# EasyEDA Pro project 2024-SS-ZT-1.eprj

# Schematic SCH

## Sheets
1 P1: Create Date: 2024-05-16; Page Name: P1; Project Name: 2024-SS-ZT-1; Schematic Name: SCH; Update Date: 2024-05-16; Company: EDA设计与开发; Page Size: A4; Version: V1.0
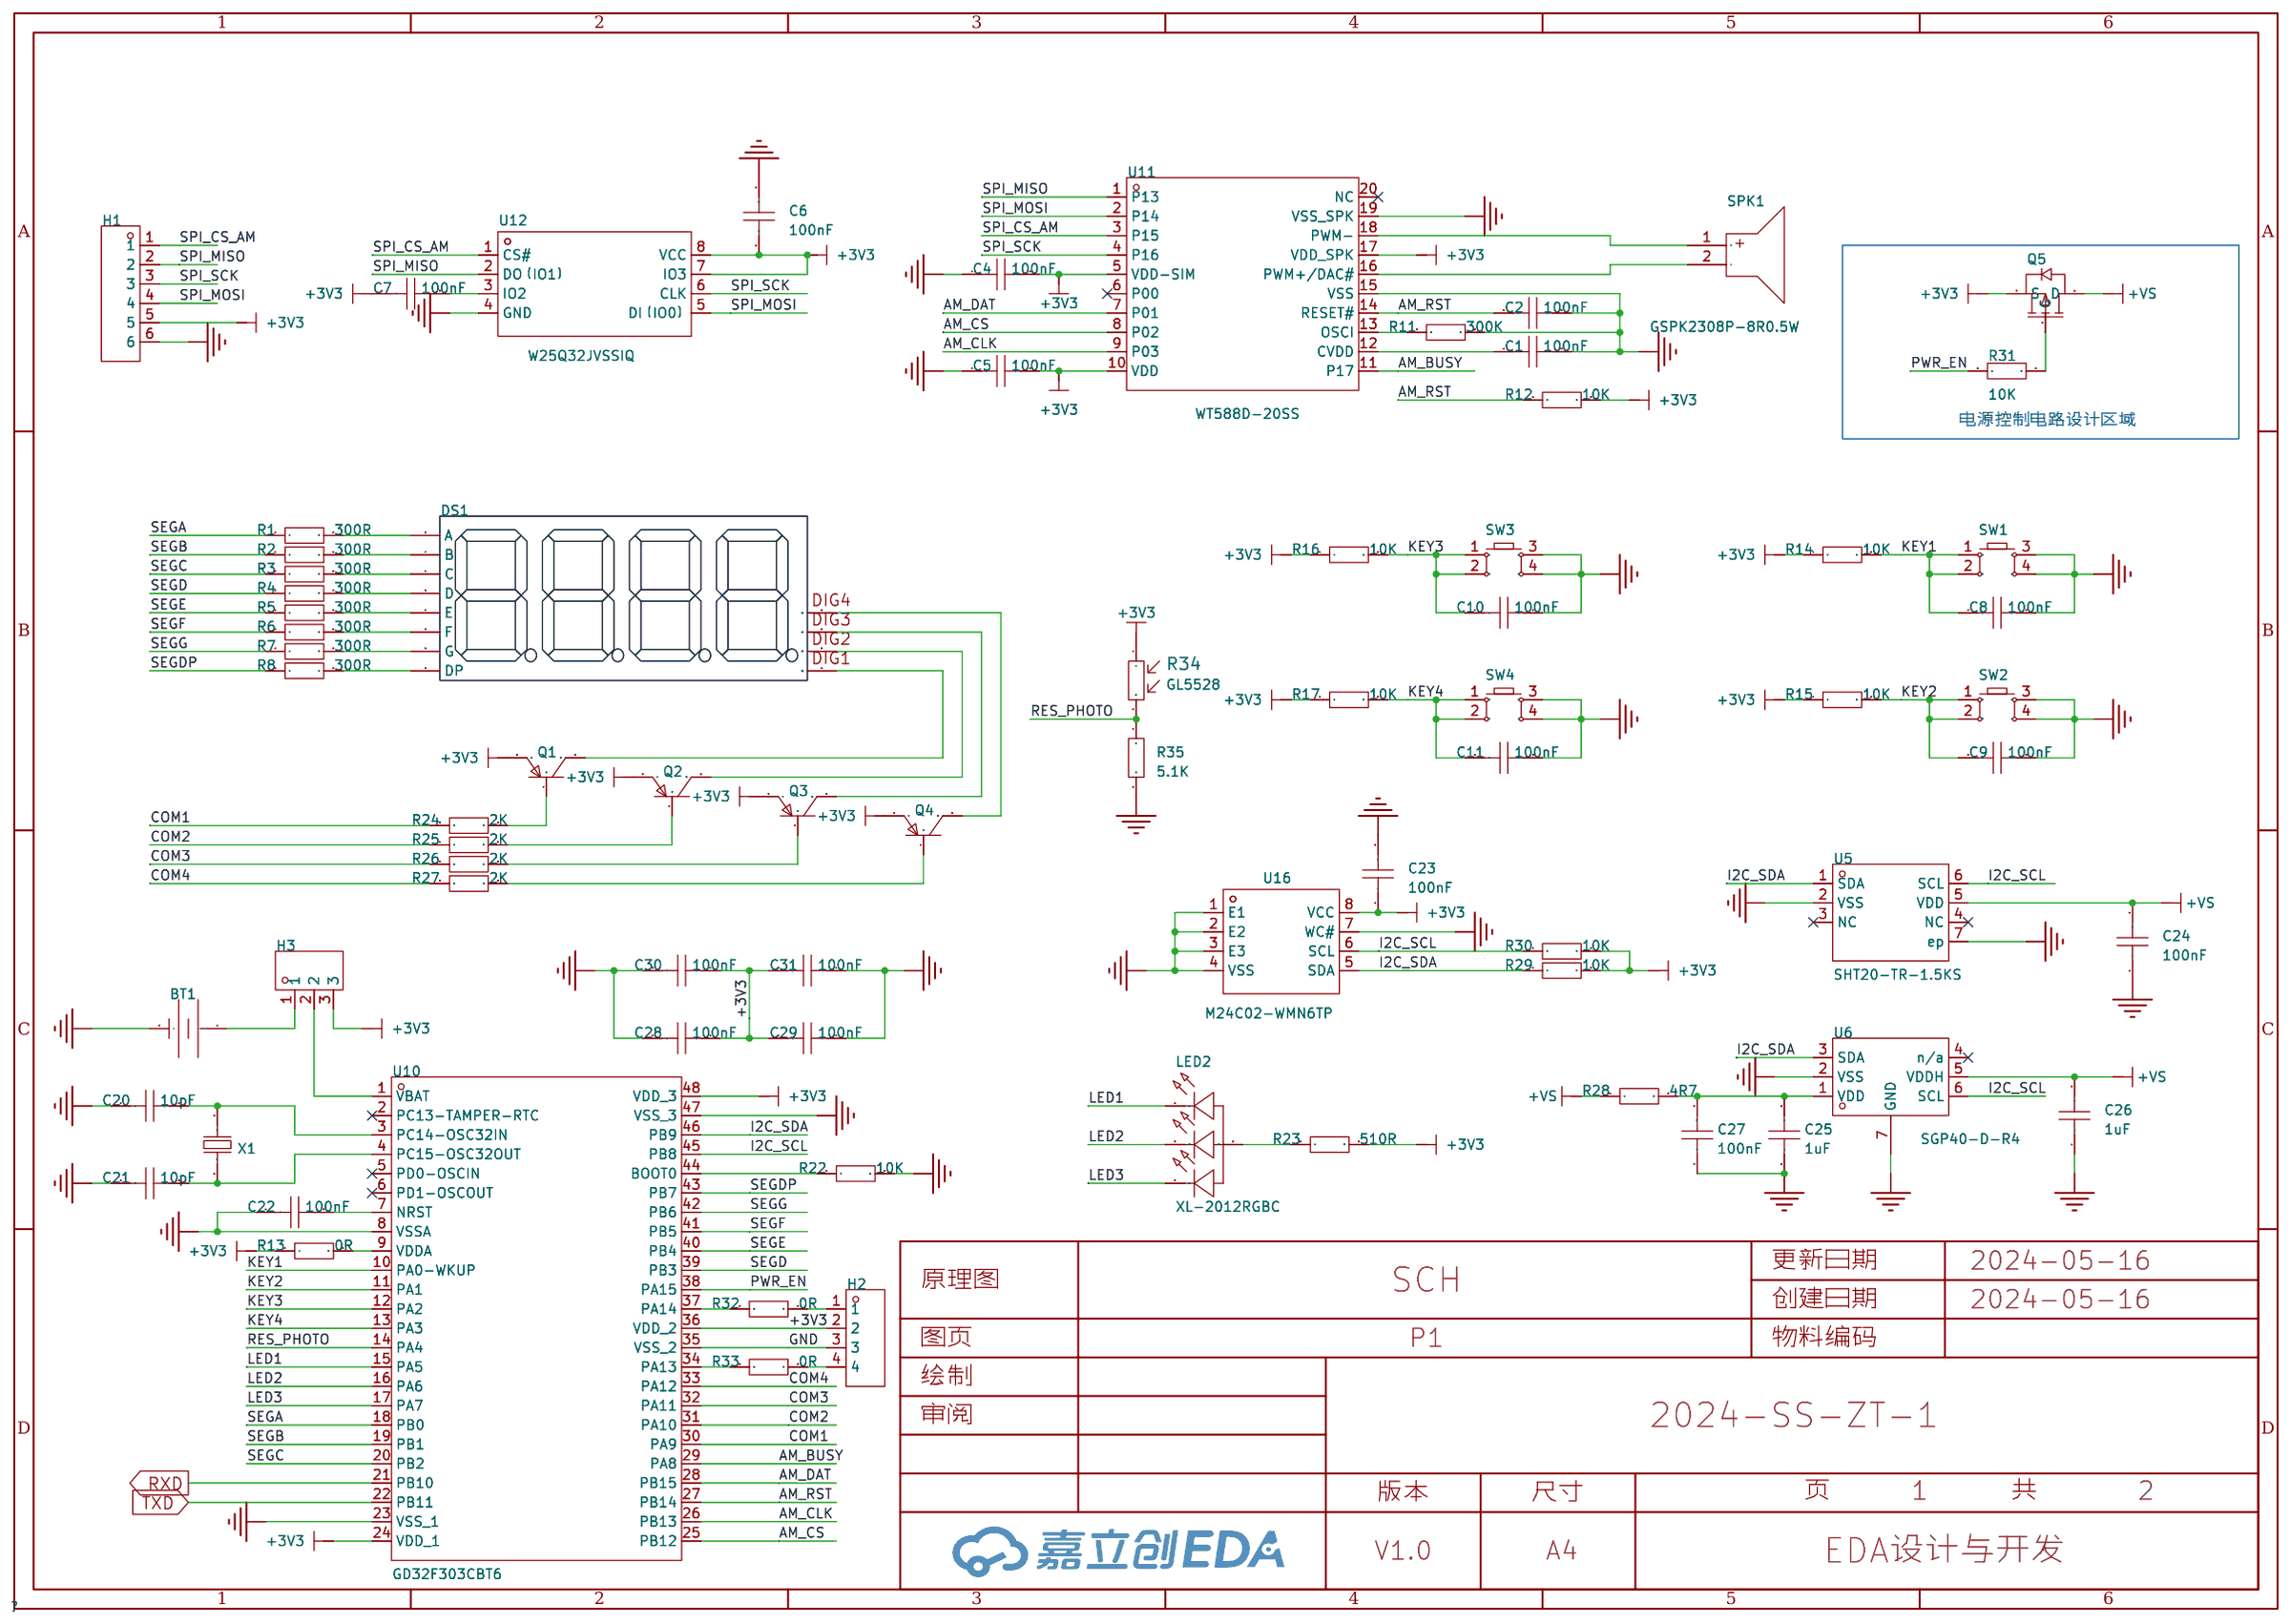
[diagram p0: P1]
2 P2: Page Name: P2; Company: 嘉立创EDA
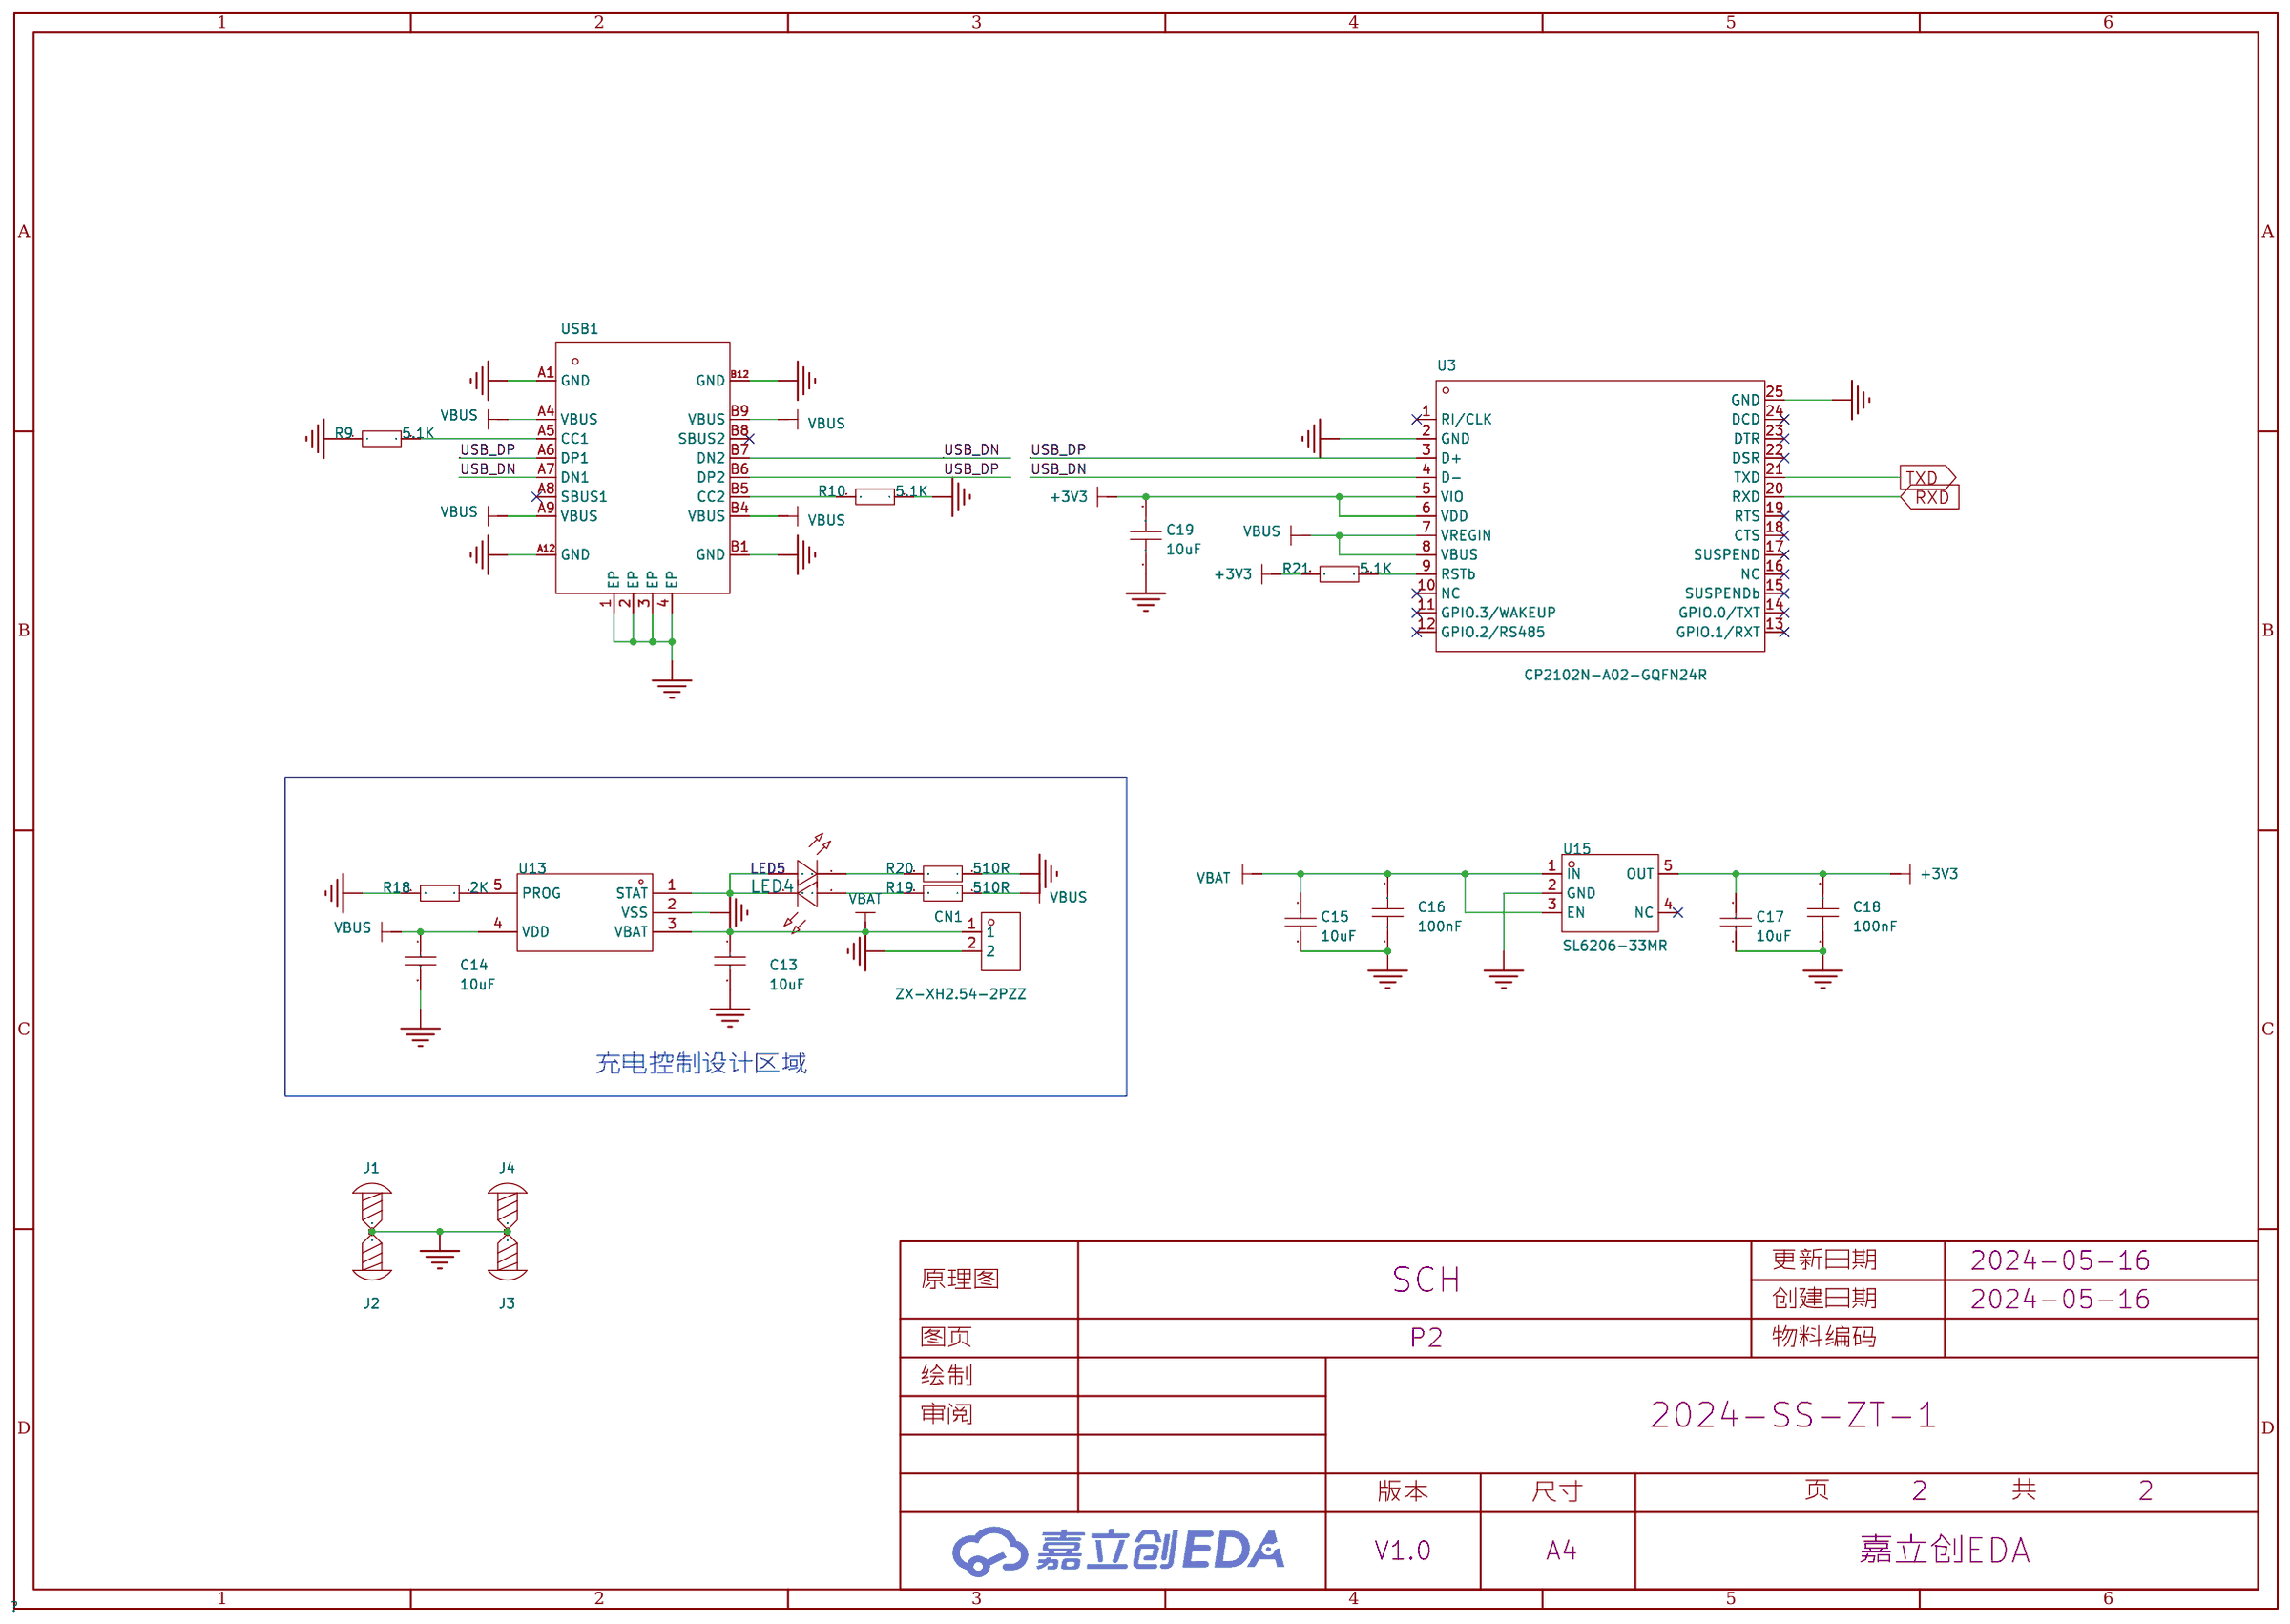
[diagram p1: P2]

## Parts
sheet P1
BT1  BS-12-B3AA003  [BAT-SMD_BS-12-B3AA011]
C1  100nF  [C0805]
C2  100nF  [C0805]
C4  100nF  [C0805]
C5  100nF  [C0805]
C6  100nF  [C0805]
C7  100nF  [C0805]
C8  100nF  [C0805]
C9  100nF  [C0805]
C10  100nF  [C0805]
C11  100nF  [C0805]
C20  10pF  [C0805]
C21  10pF  [C0805]
C22  100nF  [C0805]
C23  100nF  [C0805]
C24  100nF  [C0805]
C25  1uF  [C0805]
C26  1uF  [C0805]
C27  100nF  [C0805]
C28  100nF  [C0805]
C29  100nF  [C0805]
C30  100nF  [C0805]
C31  100nF  [C0805]
DS1  -  [LED-SEG-TH_FJ5461AH]
H1  -  [HDR-TH_6P-P2.54-V-F]
H2  -  [HDR-TH_4P-P2.54-V-F]
H3  Jumper3  [HDR-TH_3P-P2.54-V-M-A]
LED2  XL-2012RGBC  [LED-SMD_4P-L2.0-W1.3-BR]
Q1  -  [S8550P_SOT]
Q2  -  [S8550P_SOT]
Q3  -  [S8550P_SOT]
Q4  -  [S8550P_SOT]
Q5  -  [AO3401A_SOT-23-3]
R1  300R  [R0805]
R2  300R  [R0805]
R3  300R  [R0805]
R4  300R  [R0805]
R5  300R  [R0805]
R6  300R  [R0805]
R7  300R  [R0805]
R8  300R  [R0805]
R11  300K  [R0805]
R12  10K  [R0805]
R13  0R  [R0805]
R14  10K  [R0805]
R15  10K  [R0805]
R16  10K  [R0805]
R17  10K  [R0805]
R22  10K  [R0805]
R23  510R  [R0805]
R24  2K  [R0805]
R25  2K  [R0805]
R26  2K  [R0805]
R27  2K  [R0805]
R28  4R7  [R0805]
R29  10K  [R0805]
R30  10K  [R0805]
R31  10K  [R0805]
R32  0R  [R0805]
R33  0R  [R0805]
R34  GL5528  [RES-TH_L5.1-W4.3-P3.40-D0.5]
R35  5.1K  [R0805]
SPK1  GSPK2308P-8R0.5W  [SPK-TH_BD23.0-P10.00-D0.8-L-RD]
SW1  -  [Key_SMD_12x12x7.3]
SW2  -  [Key_SMD_12x12x7.3]
SW3  -  [Key_SMD_12x12x7.3]
SW4  -  [Key_SMD_12x12x7.3]
U5  SHT20-TR-1.5KS  [DFN-6_L3.0-W3.0-P0.95-TR-EP]
U6  SGP40-D-R4  [DFN-6_L2.4-W2.4-P0.80-TL-EP]
U10  GD32F303CBT6  [LQFP-48_L7.0-W7.0-P0.50-LS9.0-BL]
U11  WT588D-20SS  [SSOP-20_L7.2-W5.3-P0.65-LS7.8-BL]
U12  W25Q32JVSSIQ  [SOIC-8_L5.3-W5.3-P1.27-LS8.0-BL]
U16  M24C02-WMN6TP  [SOIC-8_L4.9-W3.9-P1.27-LS6.0-BL]
X1  32.768kHz  [FC-135R_L3.2-W1.5]
sheet P2
C13  10uF  [C1206]
C14  10uF  [C1206]
C15  10uF  [C1206]
C16  100nF  [C0805]
C17  10uF  [C1206]
C18  100nF  [C0805]
C19  10uF  [C0805]
CN1  ZX-XH2.54-2PZZ  [CONN-TH_2P-P2.50_HX25003-2A]
J1  -  [M2螺丝]
J2  -  [M2螺丝]
J3  -  [M2螺丝]
J4  -  [M2螺丝]
LED4  -  [LED_0805]
LED5  -  [LED_0805]
R9  5.1K  [R0805]
R10  5.1K  [R0805]
R18  2K  [R0805]
R19  510R  [R0805]
R20  510R  [R0805]
R21  5.1K  [R0805]
U3  CP2102N-A02-GQFN24R  [QFN-24_L4.0-W4.0-P0.50-TL-EP2.6]
U13  -  [SOP_BCON]
U15  SL6206-33MR  [SOT-23-5_L2.9-W1.6-P0.95-LS2.8-BL]
USB1  -  [USB_TYPE-C-16P]

## Library data of the parts
BT1 = BS-12-B3AA003: 连接器类型:电池底座;适用电池规格:CR1220;工作温度范围:-25℃~+85℃;; Supplier Part: C964723; Manufacturer: MYOUNG(美阳); Supplier Footprint: SMD; JLCPCB Part Class: 扩展库; Datasheet: https://atta.szlcsc.com/upload/public/pdf/source/20201218/C964723_733B638E287393F86295A2A4DAE43C75.pdf; Supplier: LCSC; Connector Type: 电池底座; Battery Type: CR1220; Operating Temperature Range: -25℃~+85℃
C1 C2 C4-C11 C16 C18-C31 = CAP_0805: Supplier Footprint: 0805
DS1 = LED_SEG_TH_0.56x4: Supplier Footprint: 插件
H1 = HDR-F_2.54_1x6P: Supplier Part: C40877; Supplier Footprint: 插件
H2 = HDR-F_2.54_1x4P: Supplier Part: C2718488; Supplier Footprint: 插件
H3 = Jumper3: Supplier Part: C2940050; Supplier Footprint: HDR-TH-3P-2.54mm; JLCPCB Part Class: 扩展库; Supplier: LCSC
LED2 = XL-2012RGBC: 发光颜色:RGB三色;功率:80mW；80mW；55mW;正向电流:25mA;主波长:619nm~624nm；463nm~466nm；524nm~527nm;二极管配置:-;透镜颜色:无色透明透镜;色温:-;发光角度:120°;载带方式:正贴;工作温度:-30℃~+85℃;; Supplier Part: C965848; Manufacturer: XINGLIGHT(成兴光); Supplier Footprint: 0805; JLCPCB Part Class: 扩展库; Datasheet: https://atta.szlcsc.com/upload/public/pdf/source/20221102/35E310354F68AE1BCFC07B93F5E395D6.pdf; Supplier: LCSC; Emitted Color: RGB三色; Power Dissipation: 80mW；80mW；55mW; Forward Current: 25mA; Dominant Wavelength: 619nm~624nm；463nm~466nm；524nm~527nm; Peak Wavelength: 624nm；528nm；469nm; Lens Color: 无色透明透镜; Viewing Angle: 120°; Mounting Sytle: 正贴; Operating Temperature: -30℃~+85℃
Q1-Q4 = S8550_SOT_PNP: Supplier Footprint: SOT-23
Q5 = AO3401A_P: Supplier Footprint: SOT-23-3L; Supplier Part: C15127
R1-R33 R35 = Res_0805: Supplier Footprint: 0805
R34 = GL5528: 暗电阻:1MΩ;亮电阻 @ 10Lux:8kΩ~20kΩ;光谱峰值(波长):540nm;; LCSC Part Name: 亮电阻:8kΩ~20kΩ 暗电阻:1MΩ; Supplier Part: C125627; Manufacturer: 森霸; Supplier Footprint: 插件,P=3mm; JLCPCB Part Class: 扩展库; Datasheet: https://atta.szlcsc.com/upload/public/pdf/source/20230427/842A99E3D53A83729D7968886D4EFCBB.pdf; Supplier: LCSC; Dark Resistance: 1MΩ; Illuminated Resistance @ 10Lux: 8kΩ~20kΩ; Applied Voltage: 150V; Spectral Peak: 540nm
SPK1 = GSPK2308P-8R0.5W: Supplier Part: C530532; Manufacturer: INGHAi(赢海); JLCPCB Part Class: 扩展库; Datasheet: https://atta.szlcsc.com/upload/public/pdf/source/20200723/C530532_3DB1F973601B36F20FBCCA52751811A3.pdf; Supplier: LCSC
SW1-SW4 = Key_SMD_12x12x7.3: Supplier Footprint: SMD
U5 = SHT20-TR-1.5KS: 接口类型:I2C;; LCSC Part Name: 1-100706-01; Supplier Part: C53865; Manufacturer: Sensirion(瑞士盛思锐); Supplier Footprint: DFN-6-EP(3x3); JLCPCB Part Class: 扩展库; Datasheet: https://atta.szlcsc.com/upload/public/pdf/source/20151012/1457707445424.pdf; Supplier: LCSC; Interface Type: I2C; Supply Voltage: 2.1V~3.6V
U6 = SGP40-D-R4: 气体类型:空气质量;精度:-;; LCSC Part Name: 3.000.384; Supplier Part: C2874215; Manufacturer: Sensirion(瑞士盛思锐); Supplier Footprint: DFN-6-EP(2.4x2.4); JLCPCB Part Class: 扩展库; Datasheet: https://atta.szlcsc.com/upload/public/pdf/source/20231011/67A6038984BE66B07B1FF2325C50691F.pdf; Supplier: LCSC; Type: 空气质量; Operating Temperature: -10℃~+50℃
U10 = GD32F303CBT6_C3013779: CPU内核:CM4;程序存储容量:128KB;RAM总容量:32KB;GPIO端口数量:37;工作电压范围:-;CPU最大主频:120MHz;程序存储器类型:FLASH;; Supplier Part: C3013779; Manufacturer: GigaDevice(兆易创新); Supplier Footprint: LQFP-48(7x7); JLCPCB Part Class: 扩展库; Datasheet: https://atta.szlcsc.com/upload/public/pdf/source/20220624/E1A57ED816B162D6D1424864911A792F.pdf; Supplier: LCSC; CPU Core: CM4; Program Storage Size: 128KB; RAM Size: 32KB; GPIO Ports Number: 37; CPU Maximum Speed: 120MHz; Program Memory Type: FLASH; ADC (Bit): 12bit; DAC (Bit): 12bit; 16Bit Timer: 7; CAN: 1; UART/USART: 3; I2C: 2; I2S: 2; SPI: 3; Peripheral/Function: 看门狗；RTC实时时钟; Watchdog: 有; Real-Time Clock: 有
U11 = WT588D-20SS: 高品质语音芯片; Supplier Part: C87498; Manufacturer: WT(唯创知音); Supplier Footprint: SSOP-20-208mil; JLCPCB Part Class: 扩展库; Datasheet: https://atta.szlcsc.com/upload/public/pdf/source/20161217/1481939141189.pdf; Supplier: LCSC
U12 = W25Q32JVSSIQ_C82344: 接口类型:SPI;存储容量:32Mbit;; Supplier Part: C82344; Manufacturer: WINBOND(华邦); Supplier Footprint: SOIC-8-208mil; JLCPCB Part Class: 扩展库; Datasheet: https://atta.szlcsc.com/upload/public/pdf/source/20160910/1473490310454.pdf; Supplier: LCSC; Interface Type: SPI; Memory Size: 32Mbit; Supply Voltage: 2.7V~3.6V; Page Programming Time (Tpp): 3ms; Operating Temperature: -40℃~+85℃
U16 = M24C02-WMN6TP: 接口类型:I2C;存储容量:2Kbit;; Supplier Part: C7562; Manufacturer: ST(意法半导体); Supplier Footprint: SOIC-8; JLCPCB Part Class: Extended Part; Datasheet: https://atta.szlcsc.com/upload/public/pdf/source/20140724/1457707167301.pdf; Supplier: LCSC; Interface Type: I2C; Memory Size: 2Kbit; Supply Voltage: 2.5V~5.5V; Operating Temperature: -40℃~+85℃
X1 = Q13FC13500004_C32346: 晶振类型:贴片晶振;频率:32.768kHz;常温频差:±20ppm;外接负载电容:12.5pF;; LCSC Part Name: 32.768kHz ±20ppm 12.5pF; Supplier Part: C32346; Manufacturer: EPSON(爱普生); Manufacturer Part: Q13FC13500004; Supplier Footprint: SMD3215-2P; JLCPCB Part Class: 基础库; Datasheet: https://atta.szlcsc.com/upload/public/pdf/source/20190108/C32346_746D6B07EAF90824457A96480007685F.pdf; Supplier: LCSC; Crystal Type: 贴片晶振; Normal temperature Frequency Tolerance: ±20ppm; External load capacitor: 12.5pF; Equivalent Series Resistance (ESR): 70kΩ; Operating Temperature: -40℃~+85℃
C13-C15 C17 = CL31A106KBHNNNE: 容值:10uF;精度:±10%;额定电压:50V;材质(温度系数):X5R;; LCSC Part Name: 10uF ±10% 50V; Supplier Part: C13585; Manufacturer: SAMSUNG(三星); Supplier Footprint: 1206; JLCPCB Part Class: 基础库; Datasheet: https://atta.szlcsc.com/upload/public/pdf/source/20160218/1457707763339.pdf; Supplier: LCSC; Tolerance: ±10%; Voltage Rated: 50V; Temperature Coefficient: X5R
CN1 = ZX-XH2.54-2PZZ: 插针结构:1x2P;间距:2.54mm;安装方式:直插;参考系列:XH;总PIN数:2P;排数:1;每排PIN数:2;行距:-;额定电流:3A;触头材质:黄铜;触头镀层:锡;工作温度范围:-25℃~+85℃;; Supplier Part: C7429632; Manufacturer: Megastar(兆星); Supplier Footprint: 插件,P=2.54mm; JLCPCB Part Class: 扩展库; Datasheet: https://atta.szlcsc.com/upload/public/pdf/source/20230619/19BA6947230AA44A04D3EDD65E618FD0.pdf; Supplier: LCSC; Pins Structure: 1x2P; Pitch: 2.54mm; Mounting Style: 直插; Reference Series: XH; Number of Pins: 2P; Number of Rows: 1; Number of PINs Per Row: 2; Current Rating (Max): 3A; Contact Material: 黄铜; Contact Plating: 锡; Operating Temperature Range: -25℃~+85℃
J1-J4 = M2螺丝: Supplier Footprint: 插件
LED4 = LED_0805-R: Supplier Footprint: 0805
LED5 = LED_0805-G: Supplier Footprint: 0805
U3 = CP2102N-A02-GQFN24R: 应用功能:USB转UART;接口协议:UART;; Supplier Part: C969151; Manufacturer: SKYWORKS/SILICON LABS(芯科); Supplier Footprint: QFN-24-EP(4x4); JLCPCB Part Class: 扩展库; Datasheet: https://atta.szlcsc.com/upload/public/pdf/source/20201204/C964632_F2B790CC23A72455AEF523510305B30A.pdf; Supplier: LCSC; Applications Function: USB转UART; Protocol: UART; Supply Voltage: 3V~3.6V; Operating Temperature: -40℃~+85℃@(Ta)
U13 = BCON
U15 = SL6206-33MR: 输出类型:-;; Supplier Part: C707122; Manufacturer: Slkor(萨科微); Supplier Footprint: SOT-23-5; JLCPCB Part Class: 扩展库; Datasheet: https://atta.szlcsc.com/upload/public/pdf/source/20200721/C707121_33633D17E61D5DC97F22208BE63A0FB1.pdf; Supplier: LCSC
USB1 = USB_TYPE-C-16P: Supplier Footprint: SMD

## Nets
+3V3: C4.2 C5.2 C6.2 C7.1 C17.2 C18.2 C19.2 C23.1 C28.1 C29.2 C30.1 C31.2 H1.5 H2.2 H3.3 Q1.2(E) Q2.2(E) Q3.2(E) Q4.2(E) Q5.2(S) R12.2 R13.1 R14.1 R15.1 R16.1 R17.1 R21.2 R23.2 R29.2 R30.2 R34.1 U3.5(VIO) U3.6(VDD) U10.24(VDD_1) U10.36(VDD_2) U10.48(VDD_3) U11.5(VDD-SIM) U11.10(VDD) U11.17(VDD_SPK) U12.7(IO3) U12.8(VCC) U15.5(OUT) U16.8(VCC)
GND: BT1.2(-) C1.2 C2.2 C4.1 C5.1 C6.1 C8.2 C9.2 C10.2 C11.2 C13.2 C14.2 C15.1 C16.1 C17.1 C18.1 C19.1 C20.1 C21.1 C22.1 C23.2 C24.1 C25.1 C26.1 C27.1 C28.2 C29.1 C30.2 C31.1 CN1.2 H1.6 H2.3 J1.1 J2.1 J3.1 J4.1 R9.1 R10.1 R11.2 R18.2 R20.1 R22.2 R35.2 SW1.3 SW1.4 SW2.3 SW2.4 SW3.3 SW3.4 SW4.3 SW4.4 U3.2(GND) U3.25(GND) U5.2(VSS) U5.7(ep) U6.2(VSS) U6.7(GND) U10.8(VSSA) U10.23(VSS_1) U10.35(VSS_2) U10.47(VSS_3) U11.15(VSS) U11.19(VSS_SPK) U12.4(GND) U13.2(VSS) U15.2(GND) U16.1(E1) U16.2(E2) U16.3(E3) U16.4(VSS) U16.7(WC#) USB1.1(EP) USB1.2(EP) USB1.3(EP) USB1.4(EP) USB1.A1(GND) USB1.A12(GND) USB1.B1(GND) USB1.B12(GND)
VBAT: C13.1 C15.2 C16.2 CN1.1 U13.3(VBAT) U15.1(IN) U15.3(EN)
VBUS: C14.1 R19.1 U3.7(VREGIN) U3.8(VBUS) U13.4(VDD) USB1.A4(VBUS) USB1.A9(VBUS) USB1.B4(VBUS) USB1.B9(VBUS)
+VS: C24.2 C26.2 Q5.3(D) R28.1 U5.5(VDD) U6.5(VDDH)
AM_BUSY: U10.29(PA8) U11.11(P17)
AM_CLK: U10.26(PB13) U11.9(P03)
AM_CS: U10.25(PB12) U11.8(P02)
AM_DAT: U10.28(PB15) U11.7(P01)
AM_RST: C2.1 R12.1 U10.27(PB14) U11.14(RESET#)
COM1: R24.1 U10.30(PA9)
COM2: R25.1 U10.31(PA10)
COM3: R26.1 U10.32(PA11)
COM4: R27.1 U10.33(PA12)
I2C_SCL: R30.1 U5.6(SCL) U6.6(SCL) U10.45(PB8) U16.6(SCL)
I2C_SDA: R29.1 U5.1(SDA) U6.3(SDA) U10.46(PB9) U16.5(SDA)
KEY1: C8.1 R14.2 SW1.1 SW1.2 U10.10(PA0-WKUP)
KEY2: C9.1 R15.2 SW2.1 SW2.2 U10.11(PA1)
KEY3: C10.1 R16.2 SW3.1 SW3.2 U10.12(PA2)
KEY4: C11.1 R17.2 SW4.1 SW4.2 U10.13(PA3)
LED1: LED2.1 U10.15(PA5)
LED2: LED2.2 U10.16(PA6)
LED3: LED2.4 U10.17(PA7)
PWR_EN: R31.2 U10.38(PA15)
RES_PHOTO: R34.2 R35.1 U10.14(PA4)
RXD: U3.20(RXD) U10.21(PB10)
SEGA: R1.1 U10.18(PB0)
SEGB: R2.1 U10.19(PB1)
SEGC: R3.1 U10.20(PB2)
SEGD: R4.1 U10.39(PB3)
SEGDP: R8.1 U10.43(PB7)
SEGE: R5.1 U10.40(PB4)
SEGF: R6.1 U10.41(PB5)
SEGG: R7.1 U10.42(PB6)
SPI_CS_AM: H1.1 U11.3(P15) U12.1(CS#)
SPI_MISO: H1.2 U11.1(P13) U12.2(DO（IO1）)
SPI_MOSI: H1.4 U11.2(P14) U12.5(DI（IO0）)
SPI_SCK: H1.3 U11.4(P16) U12.6(CLK)
TXD: U3.21(TXD) U10.22(PB11)
USB_DN: U3.4(D-) USB1.A7(DN1) USB1.B7(DN2)
USB_DP: U3.3(D+) USB1.A6(DP1) USB1.B6(DP2)
$1N1449: DS1.8(DIG3) Q3.3(C)
$1N1467: DS1.1(E) R5.2
$1N1471: DS1.2(D) R4.2
$1N1475: DS1.3(DP) R8.2
$1N1479: DS1.4(C) R3.2
$1N1483: DS1.5(G) R7.2
$1N1487: DS1.11(A) R1.2
$1N1491: DS1.7(B) R2.2
$1N1495: DS1.10(F) R6.2
$1N6161: C1.1 U11.12(CVDD)
$1N6192: R11.1 U11.13(OSCI)
$1N6375: SPK1.1(+) U11.18(PWM-)
$1N6384: SPK1.2(-) U11.16(PWM+/DAC#)
$1N6917: C7.2 U12.3(IO2)
$1N7212: R13.2 U10.9(VDDA)
$1N7925: C20.2 U10.3(PC14-OSC32IN) X1.1
$1N7930: C21.2 U10.4(PC15-OSC32OUT) X1.2
$1N8028: R22.1 U10.44(BOOT0)
$1N8104: LED2.3 R23.1
$1N8256: DS1.12(DIG1) Q1.3(C)
$1N8335: DS1.9(DIG2) Q2.3(C)
$1N8343: DS1.6(DIG4) Q4.3(C)
$1N8477: Q1.1(B) R24.2
$1N8481: Q2.1(B) R25.2
$1N8485: Q3.1(B) R26.2
$1N8489: Q4.1(B) R27.2
$1N8598: C22.2 U10.7(NRST)
$1N9384: C25.2 C27.2 R28.2 U6.1(VDD)
$1N9794: R32.1 U10.37(PA14)
$1N9795: H2.1 R32.2
$1N9824: R33.1 U10.34(PA13)
$1N9825: H2.4 R33.2
$1N10132: BT1.1(+) H3.1
$1N10135: H3.2 U10.1(VBAT)
$1N18652: Q5.1(G) R31.1
$2N394: R9.2 USB1.A5(CC1)
$2N397: R10.2 USB1.B5(CC2)
$2N1836: R21.1 U3.9(RSTb)
$2N6842: R18.1 U13.5(PROG)
$2N6856: LED4.1(C) LED5.2(A) U13.1(STAT)
$2N6873: LED4.2(A) R19.2
$2N6876: LED5.1(C) R20.2

Not connected (* = marked no-connect by the designer): U3 1(RI/CLK)* 10(NC)* 11(GPIO.3/WAKEUP)* 12(GPIO.2/RS485)* 13(GPIO.1/RXT)* 14(GPIO.0/TXT)* 15(SUSPENDb)* 16(NC)* 17(SUSPEND)* 18(CTS)* 19(RTS)* 22(DSR)* 23(DTR)* 24(DCD)*; U5 3(NC)* 4(NC)*; U6 4(n/a)*; U10 2(PC13-TAMPER-RTC)* 5(PD0-OSCIN)* 6(PD1-OSCOUT)*; U11 6(P00)* 20(NC)*; U15 4(NC)*; USB1 A8(SBUS1)* B8(SBUS2)*

## Notes on the sheets
sheet 1
- 电源控制电路设计区域
sheet 2
- 充电控制设计区域

# Board PCB
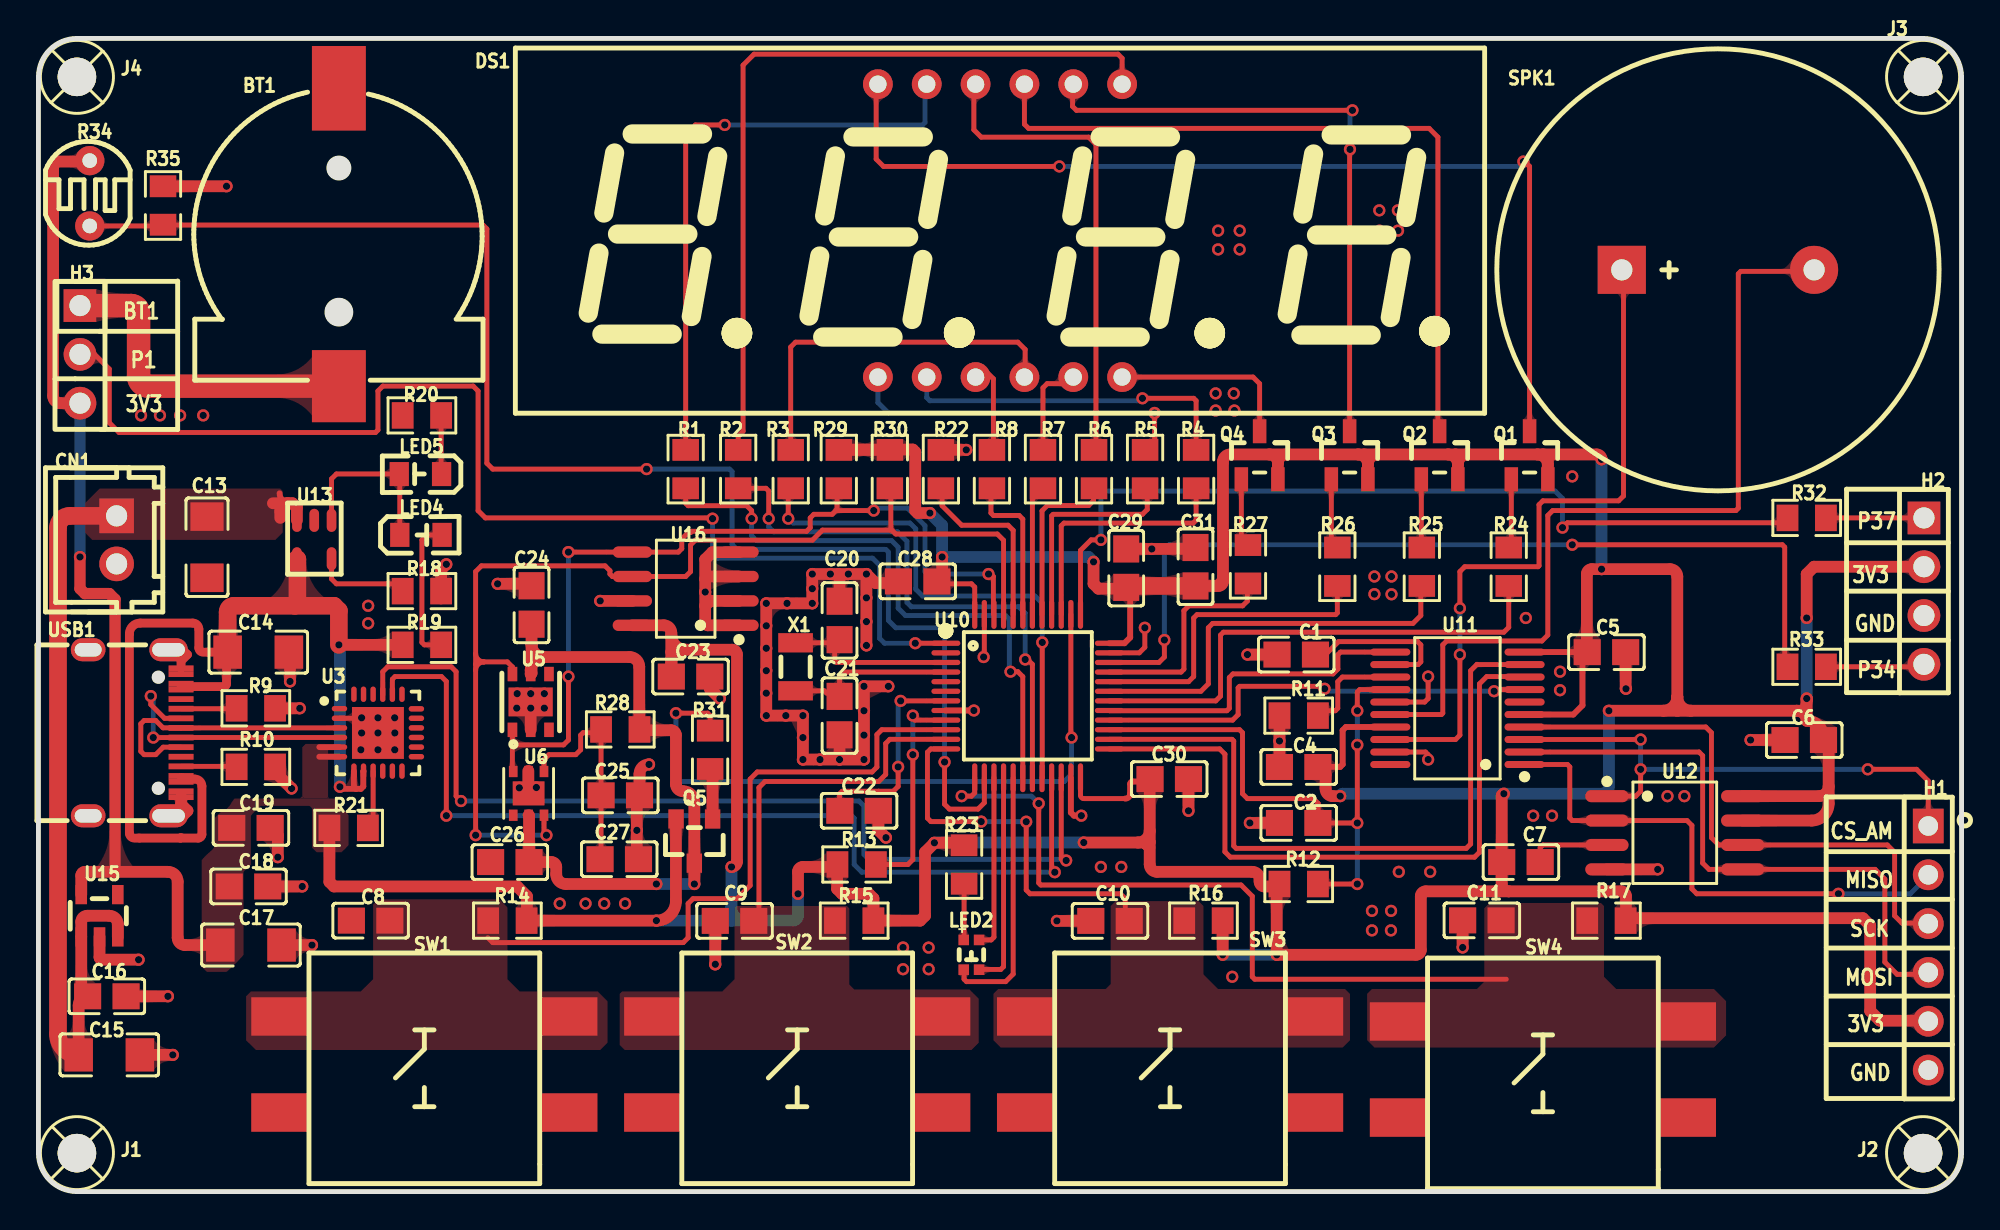
[diagram p2: board, top side]
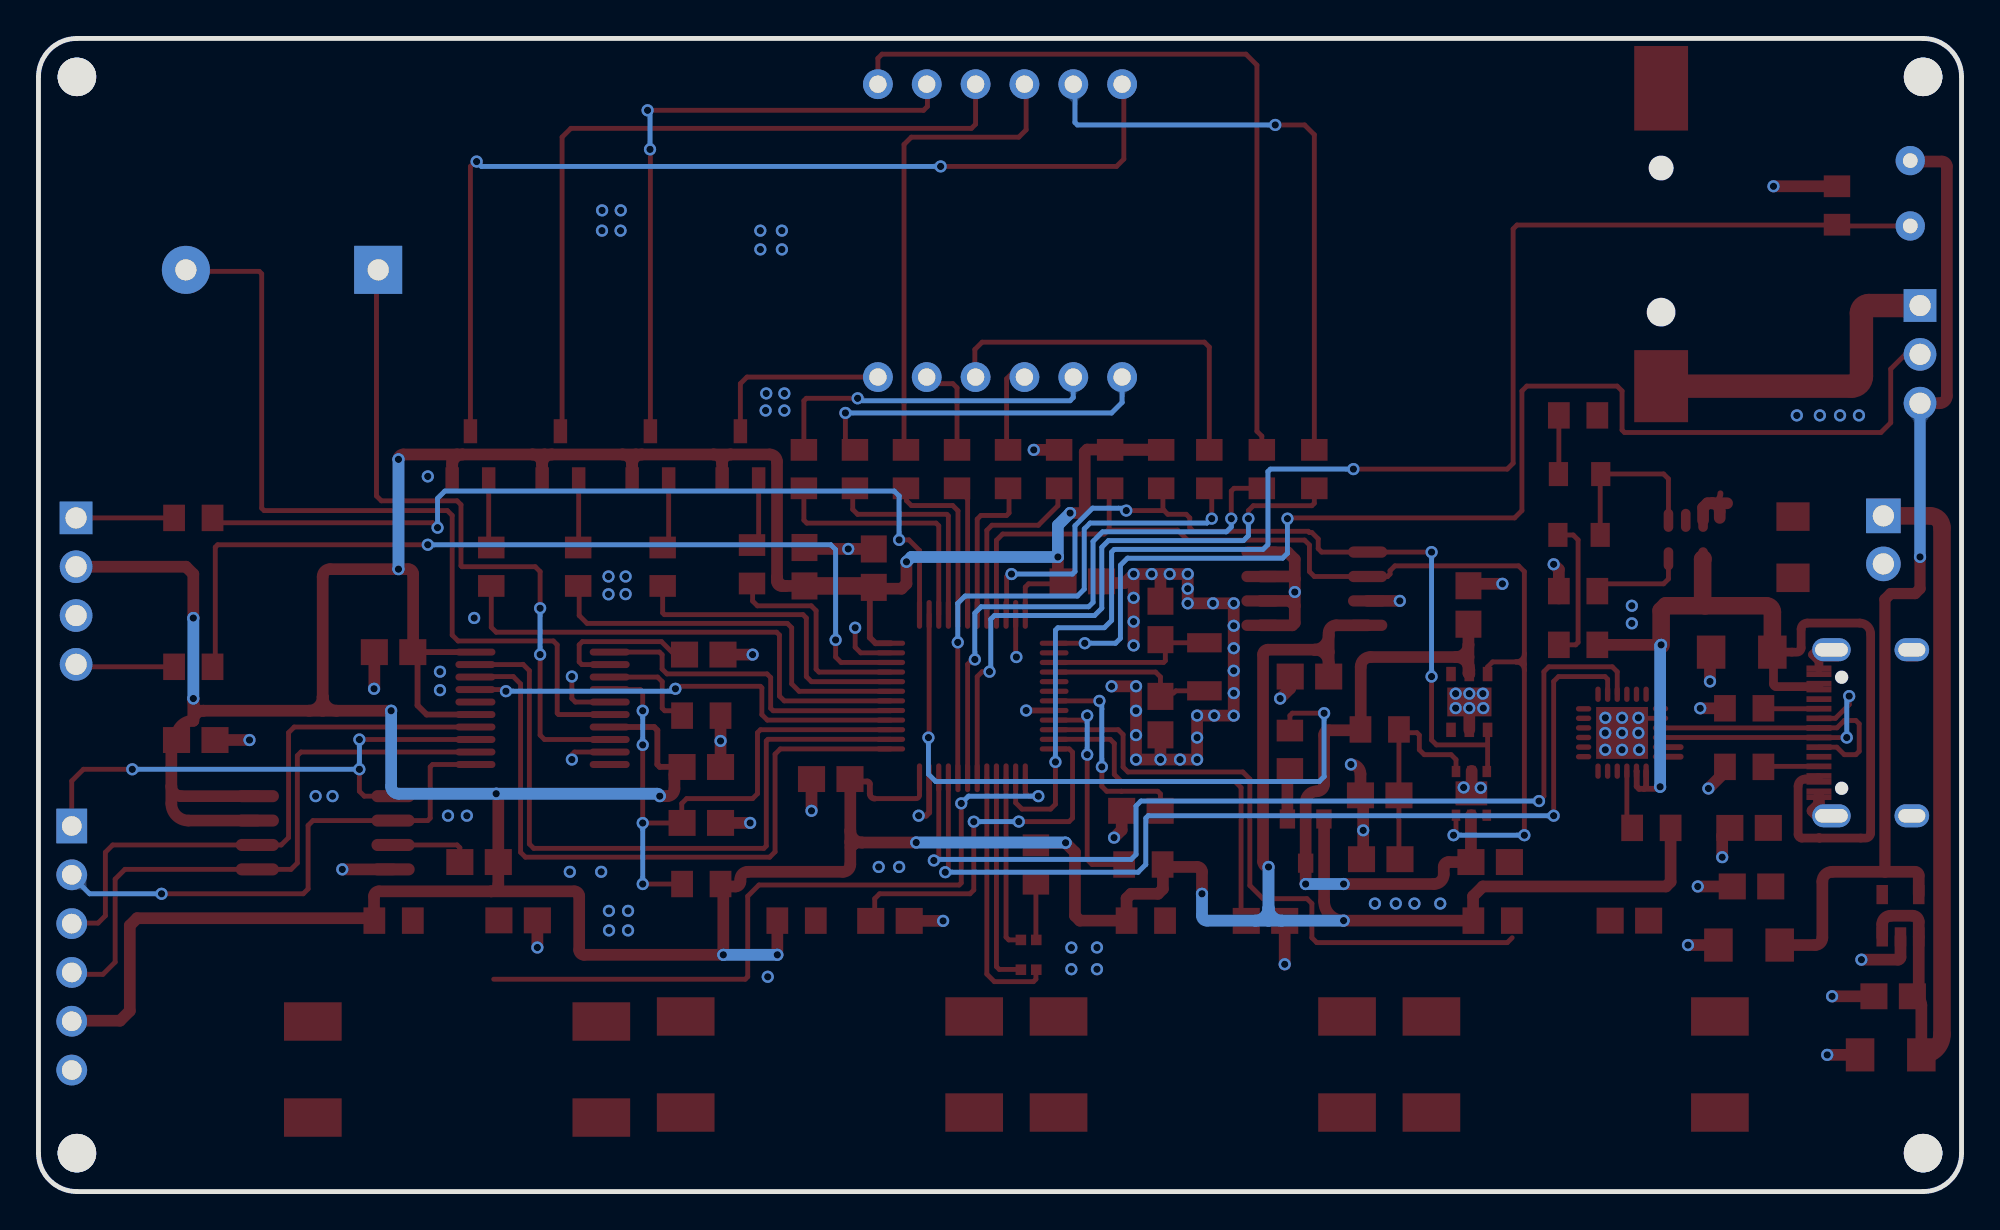
[diagram p3: board, bottom side, seen from below]

Outline 100 x 60 mm; copper layers: Top Layer, Inner1, Inner2, Inner3, Inner4, Inner5, Inner6, Inner7, Inner8, Inner9, Inner10, Inner11, Inner12, Inner13, Inner14, Inner15, Inner16, Inner17, Inner18, Inner19, Inner20, Inner21, Inner22, Inner23, Inner24, Inner25, Inner26, Inner27, Inner28, Inner29, Inner30, Bottom Layer. Coordinates in mm from the lower left corner of the outline.
Outline path: 0,58 0,2 arc(0.59,0.59) 2,0 98,0 arc(99.41,0.59) 100,2 100,58 arc(99.41,59.41) 98,60 2,60 arc(0.59,59.41) 0,58
Stack: Top Layer 0.035mm / Dielectric1 1.51mm FR4 er 4.5 / Bottom Layer 0.035mm

## Design rules (mm)
net USB_DP: DP1
net USB_DN: DP1
template: 自定义配置
spacing copperThickness1oz (default): track to track 0.203, other pairs 0.178 to 0.203
spacing copperThickness2oz: track to track 0.203, other pairs 0.152 to 0.3
track width copperThickness1oz (default): min 0.254, default 0.254, max 2.54
track width copperThickness2oz: min 0.203, default 0.254, max 2.54
track width PWR: min 0.254, default 0.61, max 2.54
differential pair differentialPair (default): width min 0.127, default 0.254, max 2.54; gap min 0.152, default 0.152
via viaSize (default): diameter min 0.635, default 0.635, max 10; hole min 0.381, default 0.381, max 6.299
net GND uses PWR
net +3V3 uses PWR
net +VS uses PWR
net VBUS uses PWR
net VBAT uses PWR

## Placement (name value [footprint] x y rotation side)
BT1  BS-12-B3AA003  [BAT-SMD_BS-12-B3AA011]  15.62 49.66 270 top
C1  100nF  [C0805]  65.41 27.94 180 top
C2  100nF  [C0805]  65.53 19.18 180 top
C4  100nF  [C0805]  65.53 22.09 0 top
C5  100nF  [C0805]  81.53 28.07 180 top
C6  100nF  [C0805]  91.82 23.5 0 top
C7  100nF  [C0805]  77.09 17.14 0 top
C8  100nF  [C0805]  17.27 14.1 180 top
C9  100nF  [C0805]  36.19 14.08 180 top
C10  100nF  [C0805]  55.72 14.08 180 top
C11  100nF  [C0805]  75.06 14.11 180 top
C13  10uF  [C1206]  8.76 33.53 270 top
C14  10uF  [C1206]  11.43 28.07 0 top
C15  10uF  [C1206]  3.68 7.11 180 top
C16  100nF  [C0805]  3.56 10.16 180 top
C17  10uF  [C1206]  11.05 12.83 180 top
C18  100nF  [C0805]  10.92 15.88 180 top
C19  10uF  [C0805]  11.05 18.92 180 top
C20  10pF  [C0805]  41.66 29.72 270 top
C21  10pF  [C0805]  41.66 24.77 90 top
C22  100nF  [C0805]  42.67 19.81 180 top
C23  100nF  [C0805]  33.91 26.8 0 top
C24  100nF  [C0805]  25.64 30.52 270 top
C25  1uF  [C0805]  30.25 20.62 180 top
C26  1uF  [C0805]  24.51 17.14 0 top
C27  100nF  [C0805]  30.2 17.29 180 top
C28  100nF  [C0805]  45.72 31.75 180 top
C29  100nF  [C0805]  56.56 32.44 270 top
C30  100nF  [C0805]  58.8 21.46 0 top
C31  100nF  [C0805]  60.17 32.51 270 top
CN1  ZX-XH2.54-2PZZ  [CONN-TH_2P-P2.50_HX25003-2A]  4.06 33.91 270 top
DS1  -  [LED-SEG-TH_FJ5461AH]  50 50 0 top
H1  -  [HDR-TH_6P-P2.54-V-F]  98.27 12.67 270 top
H2  -  [HDR-TH_4P-P2.54-V-F]  98.04 31.24 270 top
H3  Jumper3  [HDR-TH_3P-P2.54-V-M-A]  2.16 43.56 270 top
J1  -  [M2螺丝]  2 2 0 top
J2  -  [M2螺丝]  98 2 0 top
J3  -  [M2螺丝]  98 58 0 top
J4  -  [M2螺丝]  2 58 0 top
LED2  XL-2012RGBC  [LED-SMD_4P-L2.0-W1.3-BR]  48.51 12.32 90 top
LED4  -  [LED_0805]  19.94 34.16 0 top
LED5  -  [LED_0805]  19.81 37.34 180 top
Q1  -  [S8550P_SOT]  77.54 38.35 270 top
Q2  -  [S8550P_SOT]  72.86 38.35 270 top
Q3  -  [S8550P_SOT]  68.18 38.35 270 top
Q4  -  [S8550P_SOT]  63.5 38.35 270 top
Q5  -  [AO3401A_SOT-23-3]  34.11 18.24 90 top
R1  300R  [R0805]  33.66 37.59 90 top
R2  300R  [R0805]  36.39 37.59 90 top
R3  300R  [R0805]  39.12 37.59 90 top
R4  300R  [R0805]  60.2 37.59 90 top
R5  300R  [R0805]  57.54 37.59 90 top
R6  300R  [R0805]  54.89 37.59 90 top
R7  300R  [R0805]  52.24 37.59 90 top
R8  300R  [R0805]  49.58 37.59 90 top
R9  5.1K  [R0805]  11.3 25.15 180 top
R10  5.1K  [R0805]  11.3 22.1 180 top
R11  300K  [R0805]  65.53 24.77 180 top
R12  10K  [R0805]  65.53 16 180 top
R13  0R  [R0805]  42.54 17.02 0 top
R14  10K  [R0805]  24.38 14.1 180 top
R15  10K  [R0805]  42.42 14.1 180 top
R16  10K  [R0805]  60.58 14.1 180 top
R17  10K  [R0805]  81.53 14.1 180 top
R18  2K  [R0805]  19.94 31.24 0 top
R19  510R  [R0805]  19.94 28.45 0 top
R20  510R  [R0805]  19.94 40.39 0 top
R21  5.1K  [R0805]  16.13 18.92 180 top
R22  10K  [R0805]  46.93 37.59 90 top
R23  510R  [R0805]  48.13 17.02 90 top
R24  2K  [R0805]  76.45 32.51 90 top
R25  2K  [R0805]  71.93 32.51 90 top
R26  2K  [R0805]  67.54 32.51 90 top
R27  2K  [R0805]  62.9 32.64 90 top
R28  4R7  [R0805]  30.25 24.05 180 top
R29  10K  [R0805]  41.62 37.59 90 top
R30  10K  [R0805]  44.27 37.59 90 top
R31  10K  [R0805]  34.93 22.99 90 top
R32  0R  [R0805]  91.95 35.05 0 top
R33  0R  [R0805]  91.95 27.31 0 top
R34  GL5528  [RES-TH_L5.1-W4.3-P3.40-D0.5]  2.67 51.94 0 top
R35  5.1K  [R0805]  6.48 51.31 90 top
SPK1  GSPK2308P-8R0.5W  [SPK-TH_BD23.0-P10.00-D0.8-L-RD]  87.33 47.96 0 top
SW1  -  [Key_SMD_12x12x7.3]  20.07 6.61 180 top
SW2  -  [Key_SMD_12x12x7.3]  39.45 6.61 180 top
SW3  -  [Key_SMD_12x12x7.3]  58.84 6.61 180 top
SW4  -  [Key_SMD_12x12x7.3]  78.23 6.35 180 top
U3  CP2102N-A02-GQFN24R  [QFN-24_L4.0-W4.0-P0.50-TL-EP2.6]  17.65 23.88 0 top
U5  SHT20-TR-1.5KS  [DFN-6_L3.0-W3.0-P0.95-TR-EP]  25.6 25.48 180 top
U6  SGP40-D-R4  [DFN-6_L2.4-W2.4-P0.80-TL-EP]  25.49 20.72 270 top
U10  GD32F303CBT6  [LQFP-48_L7.0-W7.0-P0.50-LS9.0-BL]  51.44 25.78 270 top
U11  WT588D-20SS  [SSOP-20_L7.2-W5.3-P0.65-LS7.8-BL]  73.79 25.15 90 top
U12  W25Q32JVSSIQ  [SOIC-8_L5.3-W5.3-P1.27-LS8.0-BL]  85.09 18.67 270 top
U13  -  [SOP_BCON]  15.24 34.92 270 top
U15  SL6206-33MR  [SOT-23-5_L2.9-W1.6-P0.95-LS2.8-BL]  3.17 14.35 0 top
U16  M24C02-WMN6TP  [SOIC-8_L4.9-W3.9-P1.27-LS6.0-BL]  33.66 31.37 90 top
USB1  -  [USB_TYPE-C-16P]  5 24 270 top
X1  32.768kHz  [FC-135R_L3.2-W1.5]  39.37 27.31 270 top

## Footprints (pads in the part's own frame, mm; a bottom-side part is the same pattern mirrored in y, then rotated)
AO3401A_SOT-23-3
  rect 1x0.8 smd: 1(1.15,-0.95) 2(1.15,0.95) 3(-1.15,0)
BAT-SMD_BS-12-B3AA011
  rect 3.75x2.8 smd: 1(7.75,0)
  rect 4.4x2.8 smd: 2(-7.75,0)
C0805
  rect 1.41x1.35 smd: 1(-1,0) 2(1,0)
C1206
  rect 1.485x1.728 smd: 1(-1.593,0) 2(1.593,0)
CONN-TH_2P-P2.50_HX25003-2A
  rect 1.8x1.8 hole 1.1: 1(-1.25,0)
  round 1.8 hole 1.1: 2(1.25,0)
DFN-6_L2.4-W2.4-P0.80-TL-EP
  rect 0.585x0.448 smd: 1(-1.137,0.8) 2(-1.137,0) 3(-1.137,-0.8) 4(1.137,-0.8) 5(1.137,0) 6(1.137,0.8)
  rect 1.25x1.65 smd: 7(0,0)
DFN-6_L3.0-W3.0-P0.95-TR-EP
  rect 0.5x0.75 smd: 1(0.95,1.452) 2(0,1.451) 3(-0.95,1.45) 4(-0.95,-1.452) 5(0,-1.452) 6(0.95,-1.451)
  rect 2.3x1.5 smd: 7(0.004,-0.001)
FC-135R_L3.2-W1.5
  rect 1x1.8 smd: 1(-1.25,0) 2(1.25,0)
HDR-TH_3P-P2.54-V-M-A
  rect 1.7x1.7 hole 1.1: 1(-2.54,0)
  round 1.7 hole 1.1: 2(0,0) 3(2.54,0)
HDR-TH_4P-P2.54-V-F
  rect 1.7x1.7 hole 1.1: 1(-3.81,0)
  round 1.7 hole 1.1: 2(-1.27,0) 3(1.27,0) 4(3.81,0)
HDR-TH_6P-P2.54-V-F
  rect 1.8x1.6 hole 1.02: 1(-6.35,0)
  round 1.6 hole 1.02: 2(-3.81,0) 3(-1.27,0) 4(1.27,0) 5(3.81,0) 6(6.35,0)
Key_SMD_12x12x7.3
  rect 2.999x1.999 smd: 1(-7.5,-2.499) 2(7.5,-2.499) 3(7.5,2.499) 4(-7.5,2.499)
LED-SEG-TH_FJ5461AH
  round 1.55 hole 0.9: 1(-6.35,-7.62) 2(-3.81,-7.62) 3(-1.27,-7.62) 4(1.27,-7.62) 5(3.81,-7.62) 6(6.35,-7.62) 7(6.35,7.62) 8(3.81,7.62) 9(1.27,7.62) 10(-1.27,7.62) 11(-3.81,7.62) 12(-6.35,7.62)
LED-SMD_4P-L2.0-W1.3-BR
  rect 0.55x0.55 smd: 1(0.775,-0.4) 2(-0.775,-0.4) 3(0.775,0.4) 4(-0.775,0.4)
LED_0805
  rect 1x1.25 smd: 1(-1.15,0.005) 2(1.05,0.005)
LQFP-48_L7.0-W7.0-P0.50-LS9.0-BL
  oval 0.27x1.5 smd: 1(-2.75,-4.25) 2(-2.25,-4.25) 3(-1.75,-4.25) 4(-1.25,-4.25) 5(-0.75,-4.25) 6(-0.25,-4.25) 7(0.25,-4.25) 8(0.75,-4.25) 9(1.25,-4.25) 10(1.75,-4.25) 11(2.25,-4.25) 12(2.75,-4.25) 25(2.75,4.25) 26(2.25,4.25) 27(1.75,4.25) 28(1.25,4.25) 29(0.75,4.25) 30(0.25,4.25) 31(-0.25,4.25) 32(-0.75,4.25) 33(-1.25,4.25) 34(-1.75,4.25) 35(-2.25,4.25) 36(-2.75,4.25)
  oval 1.5x0.27 smd: 13(4.25,-2.75) 14(4.25,-2.25) 15(4.25,-1.75) 16(4.25,-1.25) 17(4.25,-0.75) 18(4.25,-0.25) 19(4.25,0.25) 20(4.25,0.75) 21(4.25,1.25) 22(4.25,1.75) 23(4.25,2.25) 24(4.25,2.75) 37(-4.25,2.75) 38(-4.25,2.25) 39(-4.25,1.75) 40(-4.25,1.25) 41(-4.25,0.75) 42(-4.25,0.25) 43(-4.25,-0.25) 44(-4.25,-0.75) 45(-4.25,-1.25) 46(-4.25,-1.75) 47(-4.25,-2.25) 48(-4.25,-2.75)
M2螺丝
  round 2 hole 2: 1(0,0)
QFN-24_L4.0-W4.0-P0.50-TL-EP2.6
  oval 0.8x0.28 smd: 1(-2,1.25) 2(-2,0.75) 3(-2,0.25) 4(-2,-0.25) 5(-2,-0.75) 6(-2,-1.25) 13(2,-1.25) 14(2,-0.75) 15(2,-0.25) 16(2,0.25) 17(2,0.75) 18(2,1.242)
  oval 0.28x0.8 smd: 7(-1.25,-2) 8(-0.75,-2) 9(-0.25,-2) 10(0.25,-2) 11(0.75,-2) 12(1.25,-2) 19(1.25,2) 20(0.75,2) 21(0.25,2) 22(-0.25,2) 23(-0.75,2) 24(-1.25,2)
  rect 2.7x2.7 smd: 25(0,-0.013)
R0805
  rect 1.133x1.377 smd: 1(-1,0) 2(1,0)
RES-TH_L5.1-W4.3-P3.40-D0.5
  round 1.524 hole 0.762: 1(0,1.7) 2(0,-1.7)
S8550P_SOT
  rect 1.25x0.701 smd: 1(1.292,-0.95) 2(1.292,0.95) 3(-1.208,0)
SOIC-8_L4.9-W3.9-P1.27-LS6.0-BL
  oval 0.588x2.045 smd: 1(-1.905,-2.772) 2(-0.635,-2.772) 3(0.635,-2.772) 4(1.905,-2.772) 5(1.905,2.772) 6(0.635,2.772) 7(-0.635,2.772) 8(-1.905,2.772)
SOIC-8_L5.3-W5.3-P1.27-LS8.0-BL
  oval 0.63x2.25 smd: 1(-1.905,-3.53) 2(-0.635,-3.53) 3(0.635,-3.53) 4(1.905,-3.53) 5(1.905,3.53) 6(0.635,3.53) 7(-0.635,3.53) 8(-1.905,3.53)
SOP_BCON
  oval 1.2x0.5 smd: 1(0,0) 2(0,-0.9) 3(0,-1.8) 4(2,-1.8) 5(2,0)
SOT-23-5_L2.9-W1.6-P0.95-LS2.8-BL
  rect 0.6x1 smd: 1(-0.95,-1.1) 2(0,-1.1) 3(0.95,-1.1) 4(0.95,1.1) 5(-0.95,1.1)
SPK-TH_BD23.0-P10.00-D0.8-L-RD
  rect 2.5x2.5 hole 1.1: 1(-5,0)
  round 2.5 hole 1.1: 2(5,0)
SSOP-20_L7.2-W5.3-P0.65-LS7.8-BL
  oval 0.364x2.082 smd: 1(-2.925,-3.491) 2(-2.275,-3.491) 3(-1.625,-3.491) 4(-0.975,-3.491) 5(-0.325,-3.491) 6(0.325,-3.491) 7(0.975,-3.491) 8(1.625,-3.491) 9(2.275,-3.491) 10(2.925,-3.491) 11(2.925,3.491) 12(2.275,3.491) 13(1.625,3.491) 14(0.975,3.491) 15(0.325,3.491) 16(-0.325,3.491) 17(-0.975,3.491) 18(-1.625,3.491) 19(-2.275,3.491) 20(-2.925,3.491)
USB_TYPE-C-16P
  oval 1.2x2 hole 0.7x1.7: 1(-4.193,1.765) 2(4.447,1.765)
  oval 1.2x1.8 hole 0.7x1.4: 3(-4.193,-2.415) 4(4.447,-2.415)
  rect 0.3x1.3 smd: A1(-3.223,2.415) A4(-2.423,2.415) A5(-1.123,2.415) A6(-0.123,2.415) A7(0.377,2.415) A8(1.377,2.415) A9(2.677,2.415) A12(3.477,2.415) B1(3.177,2.415) B4(2.377,2.415) B5(1.877,2.415) B6(0.877,2.415) B7(-0.623,2.415) B8(-1.623,2.415) B9(-2.123,2.415) B12(-2.923,2.415)

## Nets
As in the schematic.

Pads without a net: U3 1 10 11 12 13 14 15 16 17 18 19 22 23 24; U5 3 4; U6 4; U10 2 5 6; U11 6 20; U15 4; USB1 A8 B8

## Via types
v1: diameter 0.635, hole 0.381, Top Layer to Bottom Layer, 204 vias

## Routing (per net, layer and track width the routed paths; a pad name or vN(x,y) marks a point on that pad's centre or on a via; arc(x,y) is an arc through that point)
+3V3: length 396.4
  Top Layer w0.254: 56.51,20.45 54.36,20.45 arc(54.24,20.5) 54.19,20.62 U10.24 ; U10.48 48.69,31.45 48.51,31.62 46.24,31.62 46.23,31.64
  Top Layer w0.305: C4.2 66.54,22.1 67.69,22.1 67.82,22.22 67.82,24 67.99,24.17 U11.17 ; C29.2 56.77,31.23 56.77,28.83 56.47,28.53 U10.36 ; C5.2 80.53,28.07 80.29,28.07 ; 80.29,28.07 80.29,25.3 79.81,24.82 U11.5 ; 80.29,28.07 U11.10 ; U3.5 14.61,23.13 ; U3.6 14.61,22.63 ; C30.1 arc(57.8,21.43) 57.78,21.4 arc(57.74,21.35) 57.67,21.34 56.9,21.34 arc(56.81,21.3) 56.77,21.21 56.77,20.7 arc(56.69,20.52) 56.51,20.45
  Top Layer w0.584: 3.98,16.64 3.98,30.81 3.68,31.11 2.41,31.11 2.16,31.37 v1(2.16,33.02)
  Top Layer w0.61: 8.95,12.83 7.62,12.83 arc(7.35,12.94) 7.24,13.21 7.24,16.13 arc(7.09,16.49) 6.73,16.64 2.41,16.64 arc(2.28,16.58) 2.22,16.45 U15.5 ; 61.59,31.96 61.59,37.97 arc(61.71,38.24) 61.98,38.35 64,38.35 ; 61.59,31.96 61.59,31.75 arc(61.53,31.58) 61.36,31.51 61.15,31.51 ; 61.59,31.96 arc(61.46,31.64) 61.15,31.51 ; v1(46.35,35.31) 45.72,35.31 45.59,35.43 45.59,38.48 45.47,38.61 41.63,38.61 R29.2 R30.2 ; 57.17,18.16 57.52,18.16 57.59,18.09 ; 57.17,18.16 v1(54.36,18.16) ; 57.17,18.16 arc(57.61,18.34) 57.78,18.77 ; v1(54.86,32.77) 54.86,31.62 55.12,31.37 56.5,31.37 C29.2 ; R16.1 v1(61.58,12.32) ; H2.2 92.33,32.51 91.95,32.13 v1(91.95,29.84) ; 64,38.35 64.9,38.35 ; 64,38.35 arc(64.32,38.22) 64.45,37.91 ; 41.53,16.96 41.53,15.75 41.78,15.49 43.18,15.49 43.42,15.26 R15.1 45.85,14.1 46.1,14.35 46.1,17.65 46.59,18.14 v1(46.59,18.15) 48,18.15 R23.2 ; 41.53,16.96 41.53,17 R13.1 arc(41.54,16.99) 41.53,16.96 ; 41.53,16.96 arc(41.48,16.91) 41.42,16.89 39.75,16.89 arc(39.57,16.82) 39.5,16.64 v1(39.5,15.49) ; 64.9,38.35 68.62,38.35 ; 64.9,38.35 arc(64.58,38.22) 64.45,37.91 ; 68.62,38.35 68.94,38.35 ; 68.62,38.35 arc(68.98,38.21) 69.13,37.85 ; 32.91,28.94 32.91,29.07 arc(32.79,29.35) 32.51,29.46 U16.8 ; 32.91,28.94 32.91,28.07 ; 32.91,28.94 arc(33.13,28.41) 33.65,28.19 ; 25.15,14.1 R14.1 ; R14.1 v1(32.13,14.1) arc(32.85,14.39) 33.15,15.11 33.15,19.38 arc(33.15,19.38) Q5.2 ; R14.1 25.4,14.11 25.4,15.37 24.89,15.88 15.37,15.88 15.13,16.11 R21.2 ; 76.45,15.62 72.14,15.62 arc(71.96,15.55) 71.88,15.37 71.88,12.57 arc(71.81,12.39) 71.63,12.32 v1(64.39,12.32) 64.39,15.88 ; 76.45,15.62 82.3,15.62 arc(82.48,15.55) 82.55,15.37 82.55,14.11 arc(82.55,14.1) R17.1 ; 76.45,15.62 arc(76.2,15.73) 76.09,15.99 C7.1 76.09,20.59 arc(76.12,20.67) v1(76.2,20.7) ; 33.65,28.19 33.61,28.19 ; 33.65,28.19 36.07,28.19 arc(36.25,28.12) 36.32,27.94 36.32,17.18 arc(36.24,16.97) v1(36.04,16.89) ; 33.61,28.19 33.03,28.19 arc(32.94,28.16) 32.91,28.07 ; 33.61,28.19 arc(33.11,27.99) 32.91,27.49 ; 69.13,37.85 69.13,38.16 arc(69.07,38.3) 68.94,38.35 ; 69.13,37.85 Q3.2 ; 69.13,37.85 arc(69.28,38.21) 69.64,38.35 ; v1(81.66,25.02) 84.5,25.02 ; 84.5,25.02 85.22,25.02 ; 84.5,25.02 arc(85.01,25.23) 85.22,25.74 ; 85.22,25.74 85.22,32 arc(85.11,32.27) 84.84,32.39 v1(81.28,32.39) 80.77,32.39 arc(80.59,32.31) 80.52,32.13 80.52,28.08 arc(80.52,28.08) 80.52,28.07 arc(80.53,28.07) C5.2 ; 85.22,25.74 85.22,25.73 ; H1.5 98.24,8.89 95.76,8.89 95.25,9.4 95.25,13.84 94.87,14.22 82.8,14.22 ; C6.2 92.82,23.63 arc(92.57,24.24) 91.95,24.5 ; 32.91,27.49 32.91,28.07 ; 32.91,27.49 C23.1 ; 91.95,25.56 v1(91.95,25.65) arc(91.95,25.61) 91.95,25.56 ; 91.95,25.56 91.95,24.5 ; 91.95,25.56 arc(91.91,25.29) 91.82,25.02 91.43,25.02 ; 64.39,15.88 63.75,15.88 arc(63.57,15.95) 63.5,16.13 63.5,16.26 arc(63.39,16.53) 63.12,16.64 58.17,16.64 arc(57.9,16.75) 57.78,17.02 57.78,18.19 ; 64.39,15.88 64.39,16.11 arc(64.39,16.12) 64.39,16.13 ; 64.39,15.88 64.41,15.88 arc(64.49,15.91) R12.2 ; 57.77,17.91 57.59,18.09 ; 57.59,18.09 arc(57.7,18.12) 57.78,18.19 ; v1(46.99,33.02) 46.99,32.02 C28.1 ; 85.22,25.02 85.22,25.73 ; 85.22,25.02 85.93,25.02 ; 85.22,25.73 arc(85.43,25.23) 85.93,25.02 ; 78.23,38.35 81.03,38.35 arc(81.21,38.28) v1(81.28,38.1) ; 78.23,38.35 77.95,38.35 ; 78.23,38.35 arc(78.41,38.28) 78.49,38.1 78.49,37.82 ; 85.93,25.02 91.43,25.02 ; Q2.2 73.81,37.85 ; 73.81,37.85 73.81,38.23 arc(73.77,38.32) 73.69,38.35 ; 73.81,37.85 arc(73.96,38.21) 74.31,38.35 ; 73.81,37.85 arc(73.66,38.21) 73.3,38.35 ; 91.95,24.5 arc(91.8,24.87) 91.43,25.02 ; 68.94,38.35 69.64,38.35 ; 69.64,38.35 73.3,38.35 ; 93.09,21.08 93.09,20.19 arc(92.83,19.56) 92.2,19.3 U12.7 ; 93.09,21.08 93.09,23.5 ; 93.09,21.08 arc(92.94,20.72) 92.58,20.57 U12.8 ; 73.69,38.35 74.31,38.35 ; 73.69,38.35 73.3,38.35 ; 74.31,38.35 77.95,38.35 ; 78.49,37.82 78.49,37.06 arc(78.49,37.06) Q1.2 ; 78.49,37.82 arc(78.33,38.2) 77.95,38.35 ; 57.78,18.19 57.78,18.77 ; 57.78,18.77 57.78,21.45 arc(57.79,21.46) C30.1 ; v1(67.69,20.57) 67.31,20.57 arc(67.04,20.69) 66.93,20.95 66.93,21.69 arc(66.81,21.98) C4.2 ; C31.2 61.15,31.51 ; 64.39,16.13 64.41,16.13 arc(64.49,16.17) 64.53,16.26 arc(64.44,16.22) 64.39,16.13 ; Q4.2 64.45,37.91 ; H3.3 1.14,41.02 arc(0.87,41.13) 0.76,41.4 0.76,53.34 arc(0.84,53.52) 1.02,53.59 2.62,53.59 arc(2.65,53.61) R34.1
  Top Layer w0.914: 56.77,31.23 57.05,31.51 C31.2
  Bottom Layer w0.584: v1(2.16,33.02) H3.3
  Bottom Layer w0.61: v1(54.86,32.77) 54.61,33.02 v1(46.99,33.02) 46.99,34.67 v1(46.35,35.31) ; v1(54.36,18.16) 46.6,18.16 v1(46.59,18.15) ; 36.72,14.1 39.24,14.1 arc(39.42,14.17) 39.5,14.35 v1(39.5,15.49) ; 36.72,14.1 36.04,14.1 ; 36.72,14.1 arc(36.24,14.3) 36.04,14.78 ; v1(61.58,12.32) v1(64.39,12.32) ; v1(91.95,25.65) v1(91.95,29.84) ; 36.04,14.1 35.36,14.1 ; 36.04,14.1 36.04,14.78 ; 35.36,14.1 v1(32.13,14.1) ; 35.36,14.1 arc(35.84,14.3) 36.04,14.78 ; 36.04,14.78 v1(36.04,16.89) ; v1(81.66,25.02) 81.66,21.08 arc(81.55,20.81) 81.28,20.7 v1(76.2,20.7) 67.82,20.7 arc(67.73,20.66) v1(67.69,20.57) ; v1(81.28,38.1) v1(81.28,32.39)
GND: length 124.5
  Top Layer w0.254: v1(17.65,23.86) 16.89,24.63 U3.2 ; v1(72.26,26.8) 72.26,25.65 72.08,25.47 U11.15 ; U10.35 57.24,28.03 57.53,28.32 v1(57.53,29.34) ; v1(49.15,27.81) 49.19,27.85 U10.47 ; v1(72.26,22.48) 72.26,22.73 72.12,22.87 U11.19
  Top Layer w0.305: U10.23 53.69,19.72 53.85,19.56 v1(54.23,19.56) ; U10.8 v1(48.64,25.03)
  Top Layer w0.457: USB1.A1 7.42,27.61 7.75,27.94 7.49,28.19 USB1.1
  Top Layer w0.61: U15.2 3.17,12.19 arc(3.21,12.1) 3.3,12.06 v1(5.21,12.06) ; v1(82.55,26.16) 82.53,26.18 C5.1 ; 34.67,30.48 34.93,30.73 U16.2 ; 34.67,30.48 34.67,29.59 34.8,29.46 U16.1 ; 34.67,30.48 v1(34.67,31.2) 34.67,31.88 ; U5.2 25.6,25.47 U5.7 ; C11.2 v1(74.06,12.7) ; v1(43.05,32.13) v1(42.11,32.13) 41.61,32.13 ; v1(43.05,32.13) 43.52,31.66 44.64,31.66 ; v1(43.05,32.13) v1(43.05,30.89) v1(43.05,29.66) v1(43.05,28.42) ; C15.1 v1(6.98,7.11) ; 20.94,30.86 20.94,32.37 v1(21.21,32.64) ; v1(13.16,20.97) 12.3,21.83 R10.1 ; v1(23.88,31.62) 25.54,31.62 C24.1 ; C9.2 v1(35.19,11.83) 35.18,11.81 ; C16.1 v1(6.73,10.16) ; USB1.2 7.49,19.55 7.75,19.81 7.42,20.14 USB1.A12 ; 41.61,32.13 v1(41.18,32.13) v1(40.24,32.13) v1(40.24,31.37) v1(40.24,30.61) v1(38.93,30.61) v1(37.85,30.61) v1(37.85,29.44) v1(37.85,28.27) v1(37.85,27.1) v1(37.85,25.93) v1(37.85,24.77) v1(38.86,24.77) v1(39.75,24.77) v1(39.75,23.62) v1(39.75,22.48) v1(40.64,22.48) v1(41.66,22.48) ; 41.61,32.13 41.66,32.09 C20.1 ; C1.2 v1(62.87,27.94) ; C27.1 31.12,17.38 v1(31.12,18.8) 31.12,20.48 31.2,20.56 arc(31.22,20.6) C25.1 31.25,21.73 arc(31.4,22.08) v1(31.75,22.22) ; 25.47,21.89 25.47,21.03 25.48,21.02 ; 34.67,31.88 34.67,32.89 35.04,33.26 36.43,33.26 ; 34.67,31.88 34.8,32 U16.3 ; C31.1 60.09,33.44 v1(57.89,33.44) C29.1 ; C22.1 43.67,18.81 v1(44.07,18.42) ; C21.1 v1(41.66,22.48) ; v1(41.66,22.48) v1(42.93,22.48) v1(42.93,23.75) v1(42.93,25.02) v1(42.93,26.29) ; C14.2 13.08,28.01 v1(13.08,26.54) ; C19.1 12.45,18.53 v1(12.45,17.4) ; C23.2 34.91,26.18 v1(35.43,25.65) ; C10.2 v1(52.96,14.08) ; C6.1 v1(89.03,23.5) ; R11.2 v1(64.53,23.45) C4.1 ; C30.2 v1(59.8,19.81) ; C18.1 v1(13.72,15.88) ; R35.2 v1(9.78,52.31) ; C17.1 v1(14.22,12.83) ; U16.7 v1(29.21,30.73) ; v1(44.2,26.29) 42.93,26.29 ; C2.2 v1(62.99,19.18) ; v1(48.24,38.59) R22.2 ; U12.4 v1(84.2,16.76) ; R9.1 v1(13.59,25.15)
  vias: v1(5.33,40.39) v1(6.32,40.39) v1(7.37,40.39) v1(8.57,40.39) v1(16.8,24.65) v1(16.8,23.86) v1(16.76,22.99) v1(17.14,30.48) v1(17.14,29.57) v1(17.65,24.65) v1(17.65,22.99) v1(18.52,24.65) v1(18.53,23.86) v1(18.53,22.99) v1(24.89,25.91) v1(24.87,25.16) v1(25,21.01) v1(25.6,25.91) v1(25.6,25.16) v1(25.89,21.03) v1(26.31,25.91) v1(26.31,25.16) v1(27.11,14.99) v1(28.45,14.99) v1(29.42,14.99) v1(30.5,14.99) v1(44.96,12.7) v1(44.96,11.57) v1(46.29,12.69) v1(46.29,11.57) v1(55.25,16.89) v1(56.31,16.89) v1(61.21,41.53) v1(61.21,40.64) v1(61.34,50) v1(61.34,49.02) v1(62.08,11.18) v1(62.16,41.53) v1(62.19,40.64) v1(62.46,50) v1(62.46,49.02) v1(69.34,14.61) v1(69.34,13.59) v1(69.47,32) v1(69.47,31.09) v1(69.72,51.05) v1(69.73,50) v1(70.34,14.61) v1(70.33,13.59) v1(70.36,32) v1(70.36,31.08) v1(70.69,51.05) v1(70.7,50) v1(70.74,16.64) v1(72.37,16.64) v1(77.34,29.84) v1(77.72,19.56) v1(78.71,19.56) v1(79.12,27.05) v1(79.12,26.09) v1(79.76,37.21) v1(84.71,20.57) v1(85.59,20.57)
VBAT: length 45.6
  Top Layer w0.305: 12.54,36.33 arc(12.69,35.97) 13.05,35.82
  Top Layer w0.61: 12.57,35.05 12.57,35.4 arc(12.69,35.69) 12.99,35.81 ; U13.3 13.44,35.58 13.21,35.81 12.99,35.81 ; 12.99,35.81 12.19,35.81 ; U15.3 4.12,13.91 arc(4,14.22) 3.68,14.35 2.54,14.35 arc(2.32,14.26) 2.22,14.04 U15.1 2.22,10.49 arc(2.32,10.26) C16.2 arc(2.23,10.02) 2.09,9.69 C15.2
  Top Layer w0.914: CN1.1 1.63,35.16 arc(1.2,34.98) 1.02,34.54 1.02,8.19 arc(1.33,7.43) C15.2
VBUS: length 55.2
  Top Layer w0.305: U3.7 16.4,21.06 16.51,20.95 ; 16.51,20.95 15.78,20.95 v1(15.67,21.06) ; 16.51,20.95 16.76,20.95 16.89,21.08 16.89,21.86 U3.8
  Top Layer w0.457: 7.38,18.39 8.31,18.39 arc(8.44,18.45) 8.5,18.58 8.5,21.09 arc(8.39,21.35) 8.13,21.46 7.58,21.46 arc(7.5,21.48) 7.44,21.54 ; 7.38,18.39 5.12,18.39 ; 7.38,18.39 arc(7.4,18.4) 7.41,18.42 ; 7.42,26.27 9.64,26.27 arc(9.74,26.32) 9.78,26.42 9.78,28.01 arc(9.8,28.05) C14.1 ; C14.1 8.69,28.07 ; C14.1 9.96,28.07 ; 8.57,28.07 arc(8.41,28.13) 8.34,28.29 8.34,29.26 arc(8.25,29.49) 8.02,29.58 5.29,29.58 arc(4.89,29.42) 4.73,29.02 4.73,18.66 arc(4.81,18.47) 4.99,18.39
  Top Layer w0.61: v1(15.62,28.45) R19.1
  Top Layer w0.914: C14.1 9.84,30.16 arc(9.93,30.39) 10.16,30.48 13.33,30.48 ; 13.33,30.48 15.37,30.48 15.62,30.23 v1(15.62,28.45) ; 13.33,30.48 arc(13.42,30.52) 13.46,30.61 13.46,32.9 arc(13.46,32.92) U13.4
  Bottom Layer w0.61: v1(15.67,21.06) 15.67,28.4 v1(15.62,28.45)
+VS: length 36
  Top Layer w0.61: 25.64,27.81 25.64,28.45 ; 25.64,27.81 25.64,27.37 ; 25.64,27.81 26.28,27.81 ; 25.64,28.45 C24.2 ; 25.64,28.45 arc(25.83,28) 26.28,27.81 ; 25.64,27.37 25.64,26.97 U5.5 25.6,27.13 arc(25.61,27.26) 25.64,27.37 ; 25.64,27.37 arc(25.89,27.69) 26.28,27.81 ; 26.28,27.81 30.73,27.81 arc(31.09,27.66) 31.24,27.31 31.24,24.26 ; v1(34.11,16) Q5.3 34.11,20.25 arc(33.94,20.66) 33.53,20.83 arc(33.26,20.94) 33.15,21.21 33.15,23.75 arc(33.07,23.93) 32.89,24 31.3,24 arc(31.27,24.02) R28.1 ; U6.5 25.51,19.56 C26.2 26.67,17.14 arc(26.85,17.07) 26.92,16.89 26.92,16.51 arc(27.07,16.15) 27.43,16 v1(32.13,16)
  Bottom Layer w0.61: v1(34.11,16) v1(32.13,16)
AM_BUSY: length 17.3
  Top Layer w0.254: U11.11 67.71,28.07 67.57,27.93 67.57,27.19 67.32,26.94 62.11,26.94 61.93,26.75 61.93,25.15 61.8,25.02 55.7,25.02 U10.29
AM_CLK: length 36.4
  Top Layer w0.254: U10.26 62.07,23.53 62.15,23.44 62.15,17.98 62.28,17.86 74.24,17.86 74.47,18.08 74.47,27.1 74.8,27.43 74.81,27.42 U11.9
AM_CS: length 35.9
  Top Layer w0.254: U10.25 61.42,23.03 61.7,22.76 61.7,17.68 61.98,17.4 74.68,17.4 74.93,17.65 74.93,26.42 75.31,26.8 77.25,26.8 U11.8
AM_DAT: length 23.3
  Top Layer w0.254: U10.28 62.1,24.53 62.38,24.82 62.38,26.21 62.46,26.29 66.83,26.29 66.88,26.24 v1(66.88,26.16) ; U11.7 75.78,26.12 v1(75.69,26.03)
  Bottom Layer w0.254: v1(66.88,26.16) 67,26.03 v1(75.69,26.03)
AM_RST: length 31.2
  Top Layer w0.254: v1(68.58,16) R12.1 ; U10.27 62.46,24.03 62.61,23.88 62.61,20.7 62.87,20.45 66.29,20.45 66.55,20.19 66.55,19.2 C2.1 66.54,19.18 v1(68.58,19.18) v1(68.58,23.24) ; U11.14 68.71,26.12 68.58,25.99 v1(68.58,25.02)
  Bottom Layer w0.254: v1(68.58,23.24) v1(68.58,25.02) ; v1(68.58,16) v1(68.58,19.18)
COM1: length 26.4
  Top Layer w0.254: R24.1 76.45,29.36 76.2,29.11 61.62,29.11 61.47,28.96 61.47,25.78 61.22,25.53 U10.30
COM2: length 21.1
  Top Layer w0.254: R25.1 71.88,31.46 71.88,29.97 71.47,29.56 61.06,29.56 60.83,29.34 60.83,26.42 60.45,26.03 U10.31
COM3: length 16.5
  Top Layer w0.254: R26.1 67.54,30.11 67.45,30.02 60.25,30.02 60.07,29.84 60.07,26.8 59.81,26.53 U10.32
COM4: length 11.5
  Top Layer w0.254: 63.15,31.64 62.87,31.36 62.87,30.73 62.61,30.48 59.81,30.48 59.56,30.23 59.56,27.18 59.42,27.03 U10.33
I2C_SCL: length 58.3
  Top Layer w0.254: 44.32,34.47 44.32,36.54 R30.1 ; 44.32,34.47 44.27,34.42 40.77,34.42 40.25,33.9 34.16,33.9 33.91,33.64 33.91,32.26 33.66,32 U16.6 29.84,32 29.72,32.13 29.72,32.3 29.46,32.56 23.03,32.56 22.73,32.26 22.73,28 ; 44.32,34.47 44.58,34.21 49.86,34.21 50.19,33.89 U10.45 ; 22.73,27.12 22.73,27.43 ; 22.73,27.12 v1(22.73,18.54) ; 22.73,27.12 arc(22.86,27.43) 23.17,27.56 ; 22.73,27.43 22.73,28 ; 22.73,27.43 arc(22.77,27.52) 22.86,27.56 23.17,27.56 ; 23.17,27.56 24.38,27.56 24.65,27.3 U5.6 ; 23.17,27.56 arc(22.86,27.69) 22.73,28 ; 26.41,18.54 26.29,18.67 U6.6
  Bottom Layer w0.254: v1(26.42,18.54) v1(22.73,18.54)
I2C_SDA: length 44.7
  Top Layer w0.254: U6.3 24.64,21.9 24.64,23.24 ; v1(27.56,26.8) 27.56,23.5 27.31,23.24 24.64,23.24 ; U5.1 24.64,24.02 24.64,23.24 ; 41.47,35.43 41.28,35.24 40.32,35.24 40.13,35.05 40.13,34.54 39.94,34.36 33.96,34.36 33.91,34.29 33.78,34.29 33.45,33.96 33.45,33.45 33.27,33.27 U16.5 v1(27.56,33.27) ; 41.47,35.43 41.53,35.49 41.53,36.5 R29.1 ; 41.47,35.43 v1(43.43,35.43) ; U10.46 49.66,30.06 49.66,32 49.53,32.13 v1(49.4,32.13)
  Bottom Layer w0.254: v1(49.4,32.13) 46.23,32.13 46.1,32.26 46.1,34.64 45.19,35.56 43.56,35.56 v1(43.43,35.43) ; v1(27.56,33.27) v1(27.56,26.8)
KEY1: length 33.8
  Top Layer w0.254: 23.37,13.21 23.62,12.95 33.53,12.95 33.78,13.21 33.78,14.99 34.04,15.24 36.32,15.24 37.01,15.93 37.01,21.46 37.38,21.83 43.34,21.83 43.6,22.09 43.6,23.78 43.85,24.03 U10.10
KEY2: length 18.8
  Top Layer w0.254: U10.11 44.27,23.53 44.06,23.32 44.06,21.7 43.69,21.34 37.78,21.34 37.47,21.02 37.47,14.35 C9.1
KEY3: length 19.8
  Top Layer w0.254: U10.12 46.4,23.03 46.23,22.86 46.23,19.43 46.41,19.25 v1(49.02,19.25) ; v1(51.36,19.25) 51.36,15.69 51.56,15.49 56.26,15.49 56.51,15.24 56.51,14.29 C10.1
  Bottom Layer w0.254: v1(49.02,19.25) 51.36,19.25 v1(51.36,19.25)
KEY4: length 38.7
  Top Layer w0.254: v1(48.01,20.57) 48.51,20.57 48.69,20.75 U10.13 ; 76.33,11.05 63.25,11.05 63.12,11.18 63.12,15.37 62.53,15.95 52.12,15.95 52.01,16.06 v1(52.01,20.2)
  Bottom Layer w0.254: v1(52.01,20.2) 51.64,20.57 v1(48.01,20.57)
LED1: length 9.1
  Top Layer w0.254: U10.15 49.69,13.24 49.54,13.09 LED2.1
LED2: length 11.2
  Top Layer w0.254: LED2.2 48.93,11.56 50.04,11.56 50.19,11.7 U10.16
LED3: length 13.5
  Top Layer w0.254: LED2.4 48.13,11.53 48.13,11.05 48.26,10.92 50.29,10.92 50.69,11.31 U10.17
PWR_EN: length 35.1
  Top Layer w0.254: R31.2 34.93,24.77 34.8,24.89 v1(33.15,24.89) ; v1(53.72,23.62) 53.69,23.66 U10.38
  Bottom Layer w0.254: v1(53.72,23.62) 53.72,21.72 53.34,21.34 33.4,21.34 33.15,21.59 v1(33.15,24.89)
RES_PHOTO: length 77.3
  Top Layer w0.254: U10.14 49.19,20.23 48.86,19.9 47.37,19.9 47.12,20.16 v1(47.12,22.35) ; R34.2 6.41,50.24 R35.1 6.49,50.29 23.11,50.29 23.32,50.09 23.32,37.9 23.62,37.59 v1(31.62,37.59)
  Bottom Layer w0.254: v1(47.12,22.35) 47.12,29.21 46.99,29.34 44.58,29.34 44.2,29.72 44.2,33.27 44.06,33.41 36.32,33.41 36.07,33.67 36.07,37.47 35.94,37.59 v1(31.62,37.59)
RXD: length 50
  Top Layer w0.254: v1(21.21,19.56) 21.21,26.54 20.95,26.8 18.54,26.8 18.4,26.66 U3.20 ; v1(52.85,16.62) 52.69,16.78 U10.21
  Bottom Layer w0.254: v1(52.85,16.62) 42.82,16.62 42.42,17.02 42.42,19.43 42.29,19.56 v1(21.21,19.56)
SEGA: length 31.5
  Top Layer w0.254: v1(50.55,27.05) 50.93,27.05 51.19,26.79 U10.18 ; v1(37.08,35.01) 37.08,35.43 36.83,35.69 33.78,35.69 33.66,35.81 R1.1
  Bottom Layer w0.254: v1(50.55,27.05) 50.55,27.24 50.48,27.31 50.48,29.78 50.29,29.97 45.09,29.97 44.7,30.35 44.7,33.53 44.36,33.87 37.34,33.87 37.08,34.12 v1(37.08,35.01)
SEGB: length 29.4
  Top Layer w0.254: U10.19 51.69,27.43 51.43,27.69 v1(51.31,27.69) ; R2.1 37.83,36.59 37.97,36.45 37.97,35.05
  Bottom Layer w0.254: 37.97,35.05 37.97,34.58 38.23,34.33 44.67,34.33 45.16,33.83 45.16,30.66 45.39,30.43 50.98,30.43 51.31,30.1 v1(51.31,27.69)
  vias: v1(37.97,35.01)
SEGC: length 27.6
  Top Layer w0.254: v1(52.2,28.58) 52.2,21.54 U10.20 ; 38.99,35.05 38.99,36.47 R3.1
  Bottom Layer w0.254: v1(52.2,28.58) 52.2,30.61 51.82,30.99 45.97,30.99 45.62,31.34 45.62,34.48 45.31,34.79 39.24,34.79 38.99,35.04 38.99,35.05
  vias: v1(38.99,35.01)
SEGD: length 13.4
  Top Layer w0.254: U10.39 53.19,34.64 53.32,34.78 60.05,34.78 60.2,34.93 R4.1
SEGDP: length 8.1
  Top Layer w0.254: U10.43 51.19,34.99 50.99,35.18 49.66,35.18 49.53,35.31 49.53,36.54 R8.1
SEGE: length 11.4
  Top Layer w0.254: R5.1 57.66,36.48 57.66,35.49 57.4,35.24 52.76,35.24 52.69,35.16 U10.40
SEGF: length 8.9
  Top Layer w0.254: U10.41 52.19,35.42 52.46,35.7 54.61,35.7 54.86,35.95 54.86,36.57 R6.1
SEGG: length 6.8
  Top Layer w0.254: U10.42 51.69,36.04 R7.1
SPI_CS_AM: length 28.1
  Top Layer w0.254: U12.1 83.06,20.57 83.31,20.83 v1(83.31,21.97) ; U11.3 v1(83.31,23.52) ; v1(95.12,21.97) 97.66,21.97 98.27,21.36 H1.1
  Bottom Layer w0.254: v1(83.31,23.52) v1(83.31,21.97) v1(95.12,21.97)
SPI_MISO: length 27.7
  Top Layer w0.254: U11.1 79.51,22.22 79.63,22.1 79.63,19.43 79.76,19.3 U12.2 85.72,19.3 85.98,19.05 85.98,15.75 86.23,15.49 v1(93.6,15.49)
  Bottom Layer w0.254: H1.2 98.3,16.45 97.34,15.49 v1(93.6,15.49)
SPI_MOSI: length 31.6
  Top Layer w0.254: U11.2 86.35,22.87 86.54,22.68 86.54,17.09 86.87,16.76 U12.5 95.5,16.76 96.01,16.26 96.01,11.94 96.65,11.3 98.17,11.3 H1.4
SPI_SCK: length 30.4
  Top Layer w0.254: U11.4 86.7,24.17 87,23.88 87,18.42 87.38,18.03 U12.6 96.14,18.03 96.52,17.65 96.52,14.35 96.9,13.97 98.24,13.97 H1.3
TXD: length 50.8
  Top Layer w0.254: U3.21 17.9,27.05 18.16,27.31 21.46,27.31 21.72,27.05 21.72,20.57 v1(21.97,20.32) ; v1(53.44,17.23) 53.26,17.23 53.19,17.3 U10.22
  Bottom Layer w0.254: v1(21.97,20.32) 42.67,20.32 42.93,20.07 42.93,17.54 43.18,17.28 53.38,17.28 v1(53.44,17.23)
USB_DN: length 14.2
  Top Layer w0.254: USB1.B7 6.56,24.62 5.84,25.34 v1(5.84,25.78) ; v1(5.97,23.62) 7.41,23.62 ; USB1.A7 7.42,23.63 U3.4
  Bottom Layer w0.254: v1(5.84,25.78) 5.97,25.65 v1(5.97,23.62)
USB_DP: length 14.3
  Top Layer w0.254: U3.3 7.42,24.13 USB1.A6 7.41,24.13 6.48,24.13 6.1,24.51 5.5,24.51 5.32,24.34 5.32,22.91 5.5,22.73 6.1,22.73 6.49,23.12 USB1.B6
$1N1449: length 32.6
  Top Layer w0.254: Q3.3 68.18,54.21 v1(68.2,54.23) ; DS1.8 53.77,57.58 53.77,56.46 53.97,56.26 v1(68.33,56.26)
  Bottom Layer w0.254: v1(68.33,56.26) 68.2,56.13 v1(68.2,54.23)
$1N1467: length 18.1
  Top Layer w0.254: R5.2 58.04,39.09 v1(58.04,40.51)
  Bottom Layer w0.254: v1(58.04,40.51) 44.2,40.51 43.65,41.06 DS1.1
$1N1471: length 17.8
  Top Layer w0.254: R4.2 60.2,41.15 60.07,41.28 v1(57.4,41.28)
  Bottom Layer w0.254: v1(57.4,41.28) 57.28,41.28 57.15,41.15 46.35,41.15 46.19,41.31 DS1.2
$1N1475: length 5
  Top Layer w0.254: DS1.3 49.15,42.8 49.66,42.29 49.66,38.67 R8.2
$1N1479: length 19.3
  Top Layer w0.254: DS1.4 51.31,42.42 51.31,43.81 50.93,44.2 39.37,44.2 39.12,43.94 R3.2
$1N1483: length 5
  Top Layer w0.254: R7.2 52.24,41.82 52.45,42.04 53.47,42.04 DS1.5
$1N1487: length 31.1
  Top Layer w0.254: R1.2 33.66,54.99 34.16,55.5 v1(35.69,55.5)
  Bottom Layer w0.254: v1(35.69,55.5) 45.97,55.5 46.1,55.63 46.1,57.53 DS1.11
$1N1491: length 41.5
  Top Layer w0.254: DS1.7 56.35,58.97 56.13,59.18 37.21,59.18 36.64,58.61 36.64,39.56 36.39,39.31 R2.2
$1N1495: length 25
  Top Layer w0.254: R6.2 54.99,38.69 54.99,54.48 54.61,54.86 49.02,54.86 48.64,55.25 48.64,57.53 DS1.10
$1N6161: length 8.4
  Top Layer w0.254: U11.12 71.74,27.42 71.88,27.56 71.88,28.45 71.72,28.61 67.6,28.61 66.93,27.94 C1.1
$1N6192: length 5.5
  Top Layer w0.254: 66.33,25.02 66.33,25.02 67.44,25.02 67.56,25.15 67.56,26.53 67.8,26.77 U11.13
$1N6375: length 36
  Top Layer w0.254: v1(73.91,30.35) 73.91,32.26 74.17,32.51 77.98,32.51 78.03,32.56 78.03,35.74 78.23,35.94 82.17,35.94 82.42,36.19 82.42,47.87 SPK1.1 ; v1(73.91,27.94) 73.91,23.75 73.69,23.52 U11.18
  Bottom Layer w0.254: v1(73.91,27.94) v1(73.91,30.35)
$1N6384: length 44.6
  Top Layer w0.254: SPK1.2 92.13,47.75 91.31,47.75 91.19,47.88 88.52,47.88 88.39,47.75 88.39,35.56 88.26,35.43 78.74,35.43 78.49,35.18 78.49,28.96 78.18,28.65 73.22,28.65 73.03,28.45 73.03,24.89 72.95,24.82 U11.16
$1N6917: length 4.3
  Top Layer w0.254: U12.3 78.23,18.03 78.09,17.89 C7.2
$1N7212: length 11.4
  Top Layer w0.254: U10.9 45.57,24.53 45.47,24.64 v1(45.47,24.77) ; R13.2 45.21,17.02 45.47,17.27 v1(45.47,22.73)
  Bottom Layer w0.254: v1(45.47,22.73) v1(45.47,24.77)
$1N7925: length 9.2
  Top Layer w0.254: X1.1 41.11,28.56 41.24,28.43 ; 41.4,28.46 41.28,28.46 41.24,28.43 ; 41.4,28.46 C20.2 ; 41.4,28.46 41.4,27.62 41.49,27.53 U10.3 ; 41.24,28.43 41.37,28.43
$1N7930: length 9.3
  Top Layer w0.254: X1.2 40.86,26.06 40.99,25.93 ; C21.2 41.66,26.78 41.91,27.03 U10.4 ; C21.2 41.49,25.93 41.11,25.93 ; C21.2 41.4,25.51
$1N8028: length 9.5
  Top Layer w0.254: U10.44 50.69,34.41 50.42,34.67 48.01,34.67 46.99,35.69 46.99,36.53 R22.1
$1N8104: length 2.9
  Top Layer w0.254: LED2.3 48.13,13.11 R23.1
$1N8256: length 52.1
  Top Layer w0.254: v1(53.09,53.34) 43.94,53.34 43.56,53.72 43.56,57.53 DS1.12 ; Q1.3 77.54,53.34 77.28,53.59 v1(77.22,53.59)
  Bottom Layer w0.254: v1(53.09,53.34) 76.96,53.34 v1(77.22,53.59)
$1N8335: length 39.2
  Top Layer w0.254: DS1.9 51.27,55.54 51.49,55.32 72.31,55.32 72.77,54.86 72.77,39.65 Q2.3
$1N8343: length 9.8
  Top Layer w0.254: Q4.3 63.5,42.04 63.16,42.38 DS1.6
$1N8477: length 3.6
  Top Layer w0.254: Q1.1 76.59,33.65 R24.2
$1N8481: length 3.6
  Top Layer w0.254: 71.91,37.06 71.91,33.54 R25.2
$1N8485: length 3.8
  Top Layer w0.254: Q3.1 67.23,33.61 67.33,33.51 R26.2
$1N8489: length 3.6
  Top Layer w0.254: R27.2 62.55,33.98 Q4.1
$1N8598: length 11
  Top Layer w0.254: 43.69,20.83 41.79,20.83 41.66,20.69 41.66,19.83 C22.2 ; 43.69,20.83 43.68,20.82 ; 43.69,20.83 44.45,20.83 44.7,21.08 v1(44.7,22.1) ; U10.7 v1(44.83,25.53)
  Bottom Layer w0.254: v1(44.83,25.53) 44.7,25.4 v1(44.7,22.1)
$1N9384: length 11.4
  Top Layer w0.254: 29.09,23.88 29.25,23.71 C25.2 29.25,17.35 C27.2 ; 29.09,23.88 R28.2 ; 29.09,23.88 28.32,23.88 28.19,23.75 28.19,22.99 27.94,22.73 26.54,22.73 26.29,22.48 U6.1
$1N9794: length 44.6
  Top Layer w0.254: U10.37 54.19,33.36 54.74,33.91 v1(55.25,33.91) ; R32.1 90.69,34.8 79.5,34.8 v1(79.25,34.54)
  Bottom Layer w0.254: v1(55.25,33.91) 55.25,36.19 55.5,36.45 78.87,36.45 79.25,36.07 v1(79.25,34.54)
$1N9795: length 5.1
  Top Layer w0.254: H2.1 R32.2
$1N9824: length 47.3
  Top Layer w0.254: U10.34 58.26,27.53 58.55,27.81 v1(58.55,28.7) ; v1(79.76,33.66) 90.68,33.66 90.81,33.53 90.81,27.45 R33.1
  Bottom Layer w0.254: v1(58.55,28.7) 58.55,33.4 58.8,33.66 v1(79.76,33.66)
$1N9825: length 5.1
  Top Layer w0.254: H2.4 97.92,27.31 R33.2
$1N10132: length 17.3
  Top Layer w1.219: BT1.1 5.72,41.91 arc(5.36,42.06) 5.21,42.42 5.21,45.72 arc(5.1,45.99) 4.83,46.1 2.16,46.1
$1N10135: length 63
  Top Layer w0.254: U10.1 v1(45.59,28.53) ; H3.2 2.92,43.56 3.68,42.8 3.68,40 4.19,39.5 17.53,39.5 17.65,39.62 17.65,41.66 17.91,41.91 22.61,41.91 22.86,41.66 22.86,35.43 23.24,35.05 35.05,35.05
  Bottom Layer w0.254: v1(45.59,28.53) 43.99,28.53 43.74,28.78 43.74,32.59 43.37,32.96 35.31,32.96 35.05,33.21 35.05,35.05
  vias: v1(35.05,35.01)
$1N18652: length 2.7
  Top Layer w0.61: Q5.1 35.06,21.86 arc(35.02,21.95) R31.1
$2N394: length 2.9
  Top Layer w0.254: USB1.A5 10.28,25.12 R9.2
$2N397: length 2.9
  Top Layer w0.254: USB1.B5 10.28,22.12 arc(10.3,22.12) R10.2
$2N1836: length 3.1
  Top Layer w0.254: U3.9 17.4,19.2 R21.1
$2N6842: length 5
  Top Layer w0.254: U13.5 15.24,31.88 15.49,31.62 18.56,31.62 R18.1
$2N6856: length 9
  Top Layer w0.254: LED4.1 18.79,37.31 LED5.2 18.76,37.34 15.49,37.34 15.24,37.08 U13.1
$2N6873: length 7.5
  Top Layer w0.254: LED4.2 20.98,34.16 20.19,34.16 19.94,33.91 19.94,28.58 20.07,28.45 R19.2
$2N6876: length 3.3
  Top Layer w0.254: LED5.1 20.94,37.36 20.94,40.64

## Copper pours and planes (outline as drawn; the poured copper is in the pictures)
+3V3 on Top Layer: 8.49,20.45 16.13,20.45 16.13,11.43 8.49,11.43
+3V3 on Top Layer: 13.72,23.29 15.06,23.29 15.06,20.45 13.72,20.45
GND on Top Layer: -10.03,63.88 107.06,63.88 107.06,-7.87 -10.03,-7.87
GND on Bottom Layer: -2.03,64.14 104.01,64.14 104.01,-5.08 -2.03,-5.08
VBAT on Top Layer: 2.41,36.58 12.7,36.58 12.7,33.91 2.41,33.91
KEY1 on Top Layer: 10.8,15.21 29.59,15.21 29.59,7.37 10.8,7.37
KEY2 on Top Layer: 30.23,14.86 48.9,14.86 48.9,7.37 30.23,7.37
KEY3 on Top Layer: 49.66,15.11 68.2,15.11 68.2,7.49 49.66,7.49
KEY4 on Top Layer: 69.09,15.01 87.76,15.01 87.76,7.49 69.09,7.49

Small or netless copper shapes (teardrops, artwork), in the pictures only: 371 on Top Layer, 63 on Bottom Layer

## Text on the board
Top Silkscreen Layer: BT1 | 3V3 | P1 | CS_AM | MISO | MOSI | SCK | GND | P37 | P34
